# EasyEDA Pro project ProDoc_PSM_2025-09-14.epro, board PSM_PSB
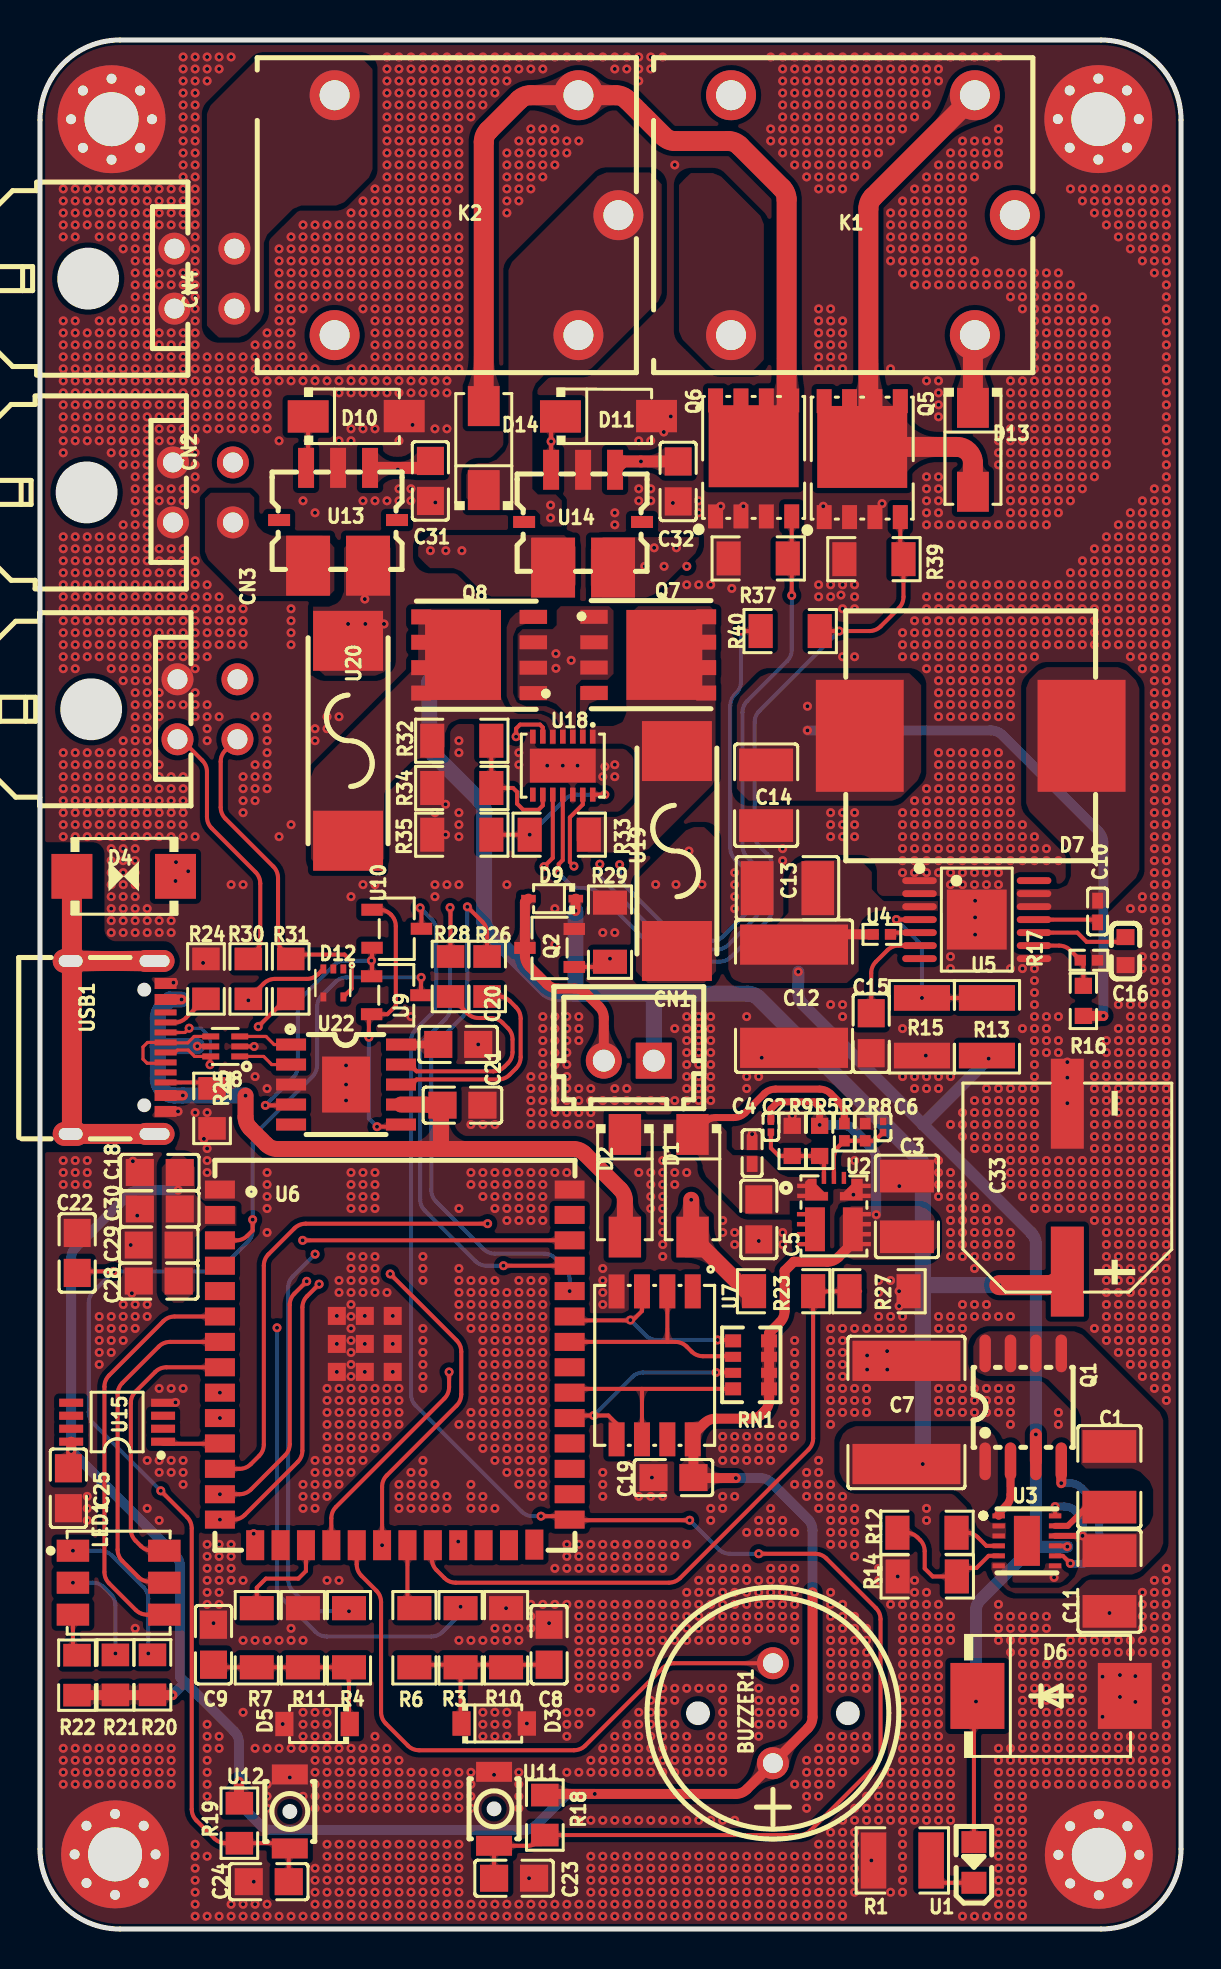
[diagram p1: board, top side]
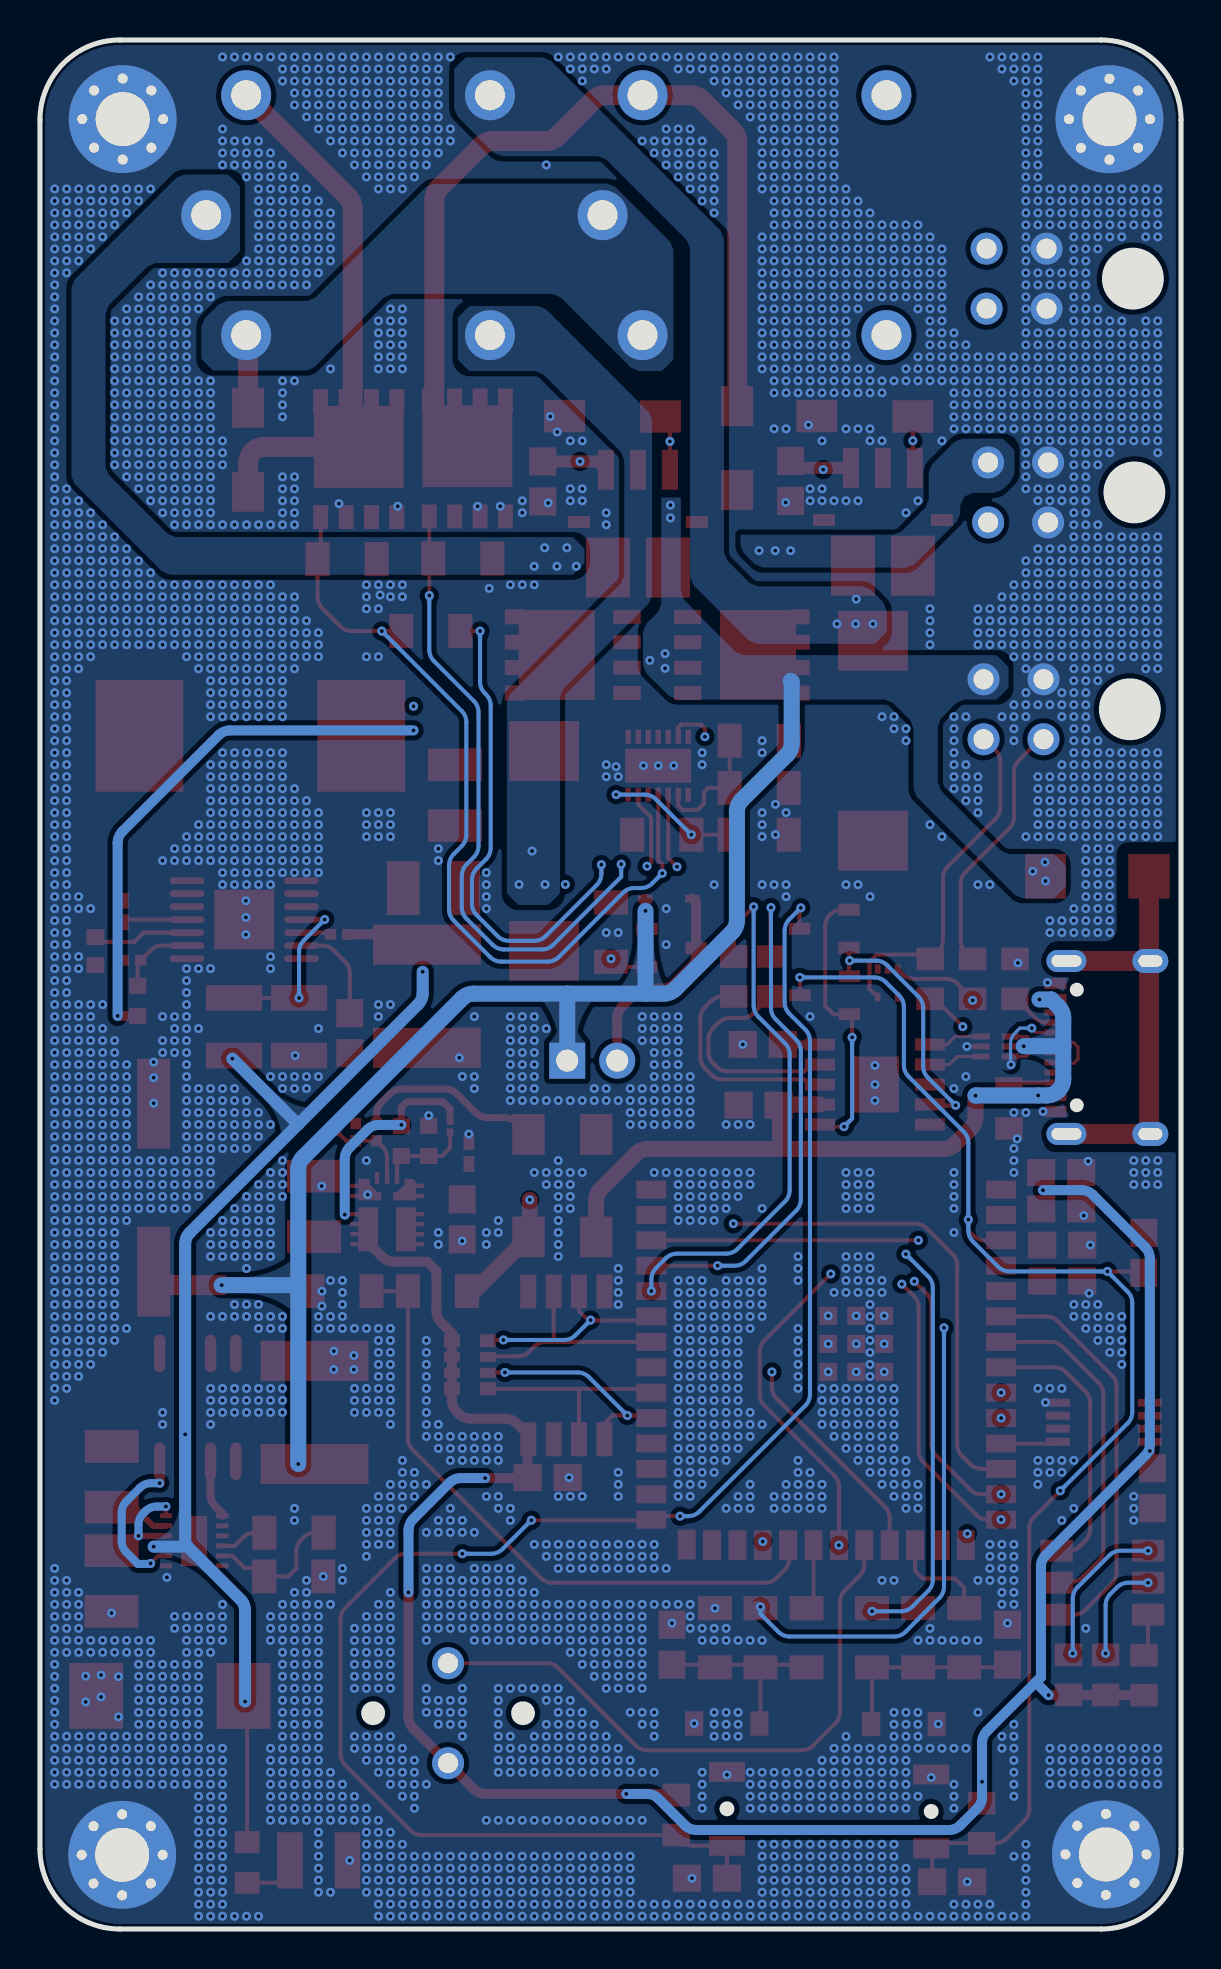
[diagram p2: board, bottom side, seen from below]

Outline 57.1 x 94.49 mm; copper layers: Top Layer, Inner1, Inner2, Bottom Layer. Coordinates in mm from the lower left corner of the outline.
Outline path: 0,90.49 0,4 arc(1.17,1.17) 4,0 53.1,0 arc(55.93,1.17) 57.1,4 57.1,90.49 arc(55.93,93.32) 53.1,94.49 4,94.49 arc(1.17,93.32) 0,90.49
Stack: Top Layer 0.035mm Outer layer thickness 1oz / Dielectric1 0.2104mm 7628 RC49% 8.6mil / Inner1 0.0152mm Inner layer thickness / Dielectric2 1.065mm 1.1mm H/HOZ Copper / Inner2 0.0152mm Inner layer thickness / Dielectric3 0.2104mm 7628 RC49% 8.6mil / Bottom Layer 0.035mm Outer layer thickness 1oz

## Design rules (mm)
net DN: DP2
net DP: DP2
net DPP: DP1
net DNN: DP1
template: Custom Config
spacing copperThickness1oz (default): track to track 0.152, other pairs 0.152 to 0.3
spacing copperThickness2oz: track to track 0.203, other pairs 0.152 to 0.3
track width copperThickness1oz (default): min 0.203, default 0.203, max 2.54
track width copperThickness2oz: min 0.203, default 0.203, max 2.54
differential pair differentialPair (default): width min 0.157, default 0.157, max 0.157; gap min 0.203, default 0.203
via viaSize (default): diameter min 0.4, default 0.45, max 10; hole min 0.2, default 0.2, max 6.3

## Placement (name value [footprint] x y rotation side)
BUZZER1  4kHz  [BUZ-TH_PKM13EPYH4002-B0]  36.68 10.8 90 top
C1  100nF  [C1210]  53.51 22.62 270 top
C2  22pF  [C0201]  36.58 40.13 90 top
C3  47uF  [C1210]  43.38 36.14 270 top
C4  100nF  [C0402]  35.64 38.81 270 top
C5  10uF  [C0805]  35.97 35.49 90 top
C6  10nF  [C0201]  42.19 40.12 270 top
C7  1uF  [C2220]  43.36 25.84 90 top
C8  100nF  [C0805]  25.48 14.22 270 top
C9  100nF  [C0805]  8.68 14.22 270 top
C10  10nF  [C0402]  52.92 50.9 270 top
C11  100nF  [C1210]  53.52 17.41 90 top
C12  1uF  [C2220]  37.73 46.66 90 top
C13  100nF  [C1210]  37.4 52.06 0 top
C14  100uF  [C1210]  36.34 56.71 90 top
C15  22nF  [C0805]  41.59 44.81 90 top
C16  1uF  [C0603]  54.32 48.91 90 top
C18  100nF  [C0805]  6 37.84 0 top
C19  100nF  [C0805]  31.7 22.58 0 top
C20  100nF  [C0805]  20.93 44.25 0 top
C21  100nF  [C0805]  21.14 41.21 0 top
C22  2.2uF  [C0805]  1.86 33.82 270 top
C23  100nF  [C0805]  23.72 2.54 0 top
C24  100nF  [C0805]  11.45 2.37 180 top
C25  100nF  [C0805]  1.42 22.05 90 top
C28  100nF  [C0805]  5.94 32.41 0 top
C29  100nF  [C0805]  5.94 34.21 0 top
C30  100nF  [C0805]  5.99 36.02 0 top
C31  100nF  [C0805]  19.54 72.43 90 top
C32  100nF  [C0805]  31.93 72.41 90 top
C33  1200uF  [CAP-SMD_BD10.0-L10.3-W10.3-FD-LS11.0]  51.41 37.08 90 top
CN1  ZX-XH2.54-2PZZ  [CONN-TH_2P-P2.50_HX25003-2A]  29.46 43.43 180 top
CN2  430450400  [CONN-TH_0430450400]  8.15 71.86 270 top
CN3  430450400  [CONN-TH_0430450400]  8.38 61.01 270 top
CN4  430450400  [CONN-TH_0430450400]  8.23 82.55 270 top
D1  US1M  [SMA_L4.4-W2.8-LS5.4-RD]  32.65 37.18 270 top
D2  US1M  [SMA_L4.4-W2.8-LS5.4-RD]  29.27 37.18 270 top
D3  MMSZ5232B  [SOD-123_L2.7-W1.6-LS3.7-RD]  22.73 10.28 0 top
D4  SMBJ58CA  [SMB_L4.6-W3.6-LS5.3-BI]  4.19 52.65 0 top
D5  MMSZ5232B  [SOD-123_L2.7-W1.6-LS3.7-RD]  13.87 10.25 180 top
D6  SMCJ58A  [SMC_L6.9-W5.8-LS7.9-RD]  50.6 11.66 0 top
D7  68uH  [IND-SMD_L12.5-W12.5-SRR1280-150M]  46.57 59.68 180 top
D8  USBLC6-2P6  [SOT-666-6_L1.6-W1.2-P0.50-LS1.6-BR]  9.27 44.15 0 top
D9  BAT46WJ,115  [SOD-323F_L2.0-W1.6-LS2.5-RD]  25.63 51.54 180 top
D10  1SMA4728A  [SMA_L4.3-W2.6-LS5.0-RD]  15.82 75.67 0 top
D11  1SMA4728A  [SMA_L4.3-W2.6-LS5.0-RD]  28.45 75.67 0 top
D12  TPD2E2U06DRLR  [SOT-553-5_L1.6-W1.2-P0.50-LS1.6-TL-1]  14.68 47.32 270 top
D13  1N4007  [SMA_L4.3-W2.5-LS5.0-RD]  46.69 73.99 270 top
D14  1N4007  [SMA_L4.3-W2.5-LS5.0-RD]  22.21 74.07 90 top
J1  SCREW-MOUNTING-HOLE-3MM  [MountingHole:MountingHole_2.7mm_M2.5_Pad_Via]  3.76 3.73 90 top
J2  SCREW-MOUNTING-HOLE-3MM  [MountingHole:MountingHole_2.7mm_M2.5_Pad_Via]  3.58 90.53 180 top
J3  SCREW-MOUNTING-HOLE-3MM  [MountingHole:MountingHole_2.7mm_M2.5_Pad_Via]  52.98 3.71 0 top
J4  SCREW-MOUNTING-HOLE-3MM  [MountingHole:MountingHole_2.7mm_M2.5_Pad_Via]  52.96 90.53 0 top
K1  SRD-48VDC-SL-C  [RELAY-TH_SRD-48VDC-SL-C]  41.68 85.73 180 top
K2  SRD-48VDC-SL-C  [RELAY-TH_SRD-48VDC-SL-C]  21.84 85.73 180 top
LED1  HL-AF-5060H271BU46FU79GC-S1-THL  [LED-ARRAY-SMD_6P-L5.4-W5.0-TL-FD]  3.94 17.32 0 top
Q1  FDS3992  [SO-8_L4.9-W3.9-P1.27-LS5.9-BL]  49.2 26.09 0 top
Q2  AO3400A  [SOT-23-3_L2.9-W1.6-P1.90-LS2.8-BR]  25.5 49.07 0 top
Q5  SI7456  [POWERPAK-SO-8_L5.9-W4.9-P1.27-LS6.2-BL]  41.15 73.52 0 top
Q6  SI7456  [POWERPAK-SO-8_L5.9-W4.9-P1.27-LS6.2-BL]  35.71 73.56 0 top
Q7  CSD19532Q5B  [SON-8_L5.0-W6.0-P1.27-BL-1]  30.53 63.73 270 top
Q8  CSD19532Q5B  [SON-8_L5.0-W6.0-P1.27-BL-1]  21.88 63.73 90 top
R1  22kΩ  [R1210]  43.15 3.43 0 top
R2  22.1kΩ  [R0402]  40.25 39.86 90 top
R3  180kΩ  [R1206]  21.05 14.57 270 top
R4  180kΩ  [R1206]  15.46 14.57 270 top
R5  135kΩ  [R0603]  39.01 39.42 90 top
R6  100Ω  [R1206]  18.74 14.57 90 top
R7  100Ω  [R1206]  10.85 14.57 90 top
R8  10kΩ  [R0402]  41.3 39.86 270 top
R9  30kΩ  [R0603]  37.64 39.42 270 top
R10  10kΩ  [R1206]  23.32 14.57 90 top
R11  10kΩ  [R1206]  13.16 14.57 90 top
R12  105kΩ  [R1206]  44.39 19.82 0 top
R13  75kΩ  [R1210]  47.39 45.13 270 top
R14  2.21kΩ  [R1206]  44.4 17.63 0 top
R15  2.8kΩ  [R1210]  44.13 45.13 90 top
R16  3kΩ  [R0603]  52.21 46.43 270 top
R17  2kΩ  [R0402]  52.49 48.46 180 top
R18  10kΩ  [R0805]  25.26 5.7 270 top
R19  10kΩ  [R0805]  9.98 5.29 270 top
R20  300Ω  [R0805]  1.85 12.7 270 top
R21  300Ω  [R0805]  3.78 12.71 270 top
R22  300Ω  [R0805]  5.63 12.71 270 top
R23  33kΩ  [R1206]  37.21 31.9 180 top
R24  5.1kΩ  [R0805]  8.31 47.52 270 top
R25  5.1kΩ  [R0805]  8.61 41.05 90 top
R26  0Ω  [R0805]  22.37 47.65 90 top
R27  33kΩ  [R1206]  41.99 31.9 180 top
R28  0Ω  [R0805]  20.55 47.65 90 top
R29  68kΩ  [R1206]  28.52 49.86 90 top
R30  33Ω  [R0805]  10.43 47.52 90 top
R31  33Ω  [R0805]  12.55 47.52 90 top
R32  340kΩ  [R1206]  21.11 59.44 180 top
R33  340kΩ  [R1206]  25.98 54.74 0 top
R34  12.7kΩ  [R1206]  21.11 57.07 0 top
R35  12.7kΩ  [R1206]  21.11 54.74 0 top
R37  33kΩ  [R1206]  35.94 68.55 180 top
R39  10MΩ  [R1206]  41.73 68.52 0 top
R40  10kΩ  [R1206]  37.54 64.92 180 top
RN1  10kΩ  [RES-ARRAY-SMD_0603-8P-L3.2-W1.6-BL]  35.59 28.22 270 top
U1  APT2012LZGCK  [LED-SMD_L2.0-W1.3-R-RD]  46.73 3.33 90 top
U2  TPSM863252RDXR  [QFN-7_L4.0-W3.3_TPSM863257RDXR]  39.73 36.28 0 top
U3  LM74800QDRRRQ1  [WSON-12_L3.0-W3.0-P0.50-TL-EP-2]  49.39 19.41 0 top
U4  261kΩ  [R0402]  42.13 49.75 180 top
U5  LM5161PWPR  [HTSSOP-14_L5.0-W4.4-P0.65-LS6.4-BL-EP3.0]  46.88 50.49 270 top
U6  ESP32-S3-WROOM-1U-N8R8  [WIRELM-SMD_ESP32-S3-WROOM-1U]  17.75 28.09 0 top
U7  MKDV8GIL-AST  [LGA-8_L6.0-W8.0-P1.27-TL]  30.76 28.19 270 top
U9  BSS138  [SOT-23-3_L2.9-W1.6-P1.90-LS2.8-BR]  17.83 46.71 180 top
U10  BSS138  [SOT-23-3_L2.9-W1.6-P1.90-LS2.8-BR]  17.85 50.03 180 top
U11  TD-1183SN-1.7H-250  [KEY-SMD_L3.0-W2.5-LS4.0]  22.72 6.01 90 top
U12  TD-1183SN-1.7H-250  [KEY-SMD_L3.0-W2.5-LS4.0]  12.5 5.88 90 top
U13  ACS781LLRTR-100B-T  [PSOF-7_L6.4-W4.8-BL]  14.92 70.64 180 top
U14  ACS781LLRTR-100B-T  [PSOF-7_L6.4-W4.8-BL]  27.18 70.54 180 top
U15  DS18B20U-MS  [MSOP-8_L3.0-W3.0-P0.65-LS4.9-BL-1]  3.86 25.35 90 top
U18  LTC4355IDE#PBF  [DFN-14_L4.0-W3.0-P0.50-BL-EP]  26.16 58.19 180 top
U19  SCT1032T6.3A250V  [FUSE-SMD_L10.3-W3.3]  31.87 53.92 90 top
U20  SCT1032T6.3A250V  [FUSE-SMD_L10.3-W3.3]  15.42 59.44 270 top
U22  CH340K  [ESOP-10_L4.9-W3.9-P1.00-LS6.2-BL-EP]  15.32 42.24 270 top
USB1  TYPE-C 16PIN 2MD(073)  [USB-C-SMD_TYPE-C-6PIN-2MD-073]  3.91 44.09 270 top

## Footprints (pads in the part's own frame, mm; a bottom-side part is the same pattern mirrored in y, then rotated)
BUZ-TH_PKM13EPYH4002-B0
  round 1.6 hole 1: 1(-2.5,0) 2(2.5,0)
C0201
  rect 0.368x0.324 smd: 1(-0.275,0) 2(0.275,0)
C0402
  rect 0.79x0.54 smd: 1(-0.545,0) 2(0.545,0)
C0603
  rect 0.8x0.9 smd: 1(-0.7,0) 2(0.7,0)
C0805
  rect 1.41x1.35 smd: 1(-1,0) 2(1,0)
C1210
  rect 1.635x2.7 smd: 1(-1.518,0) 2(1.518,0)
C2220
  rect 2.01x5.4 smd: 1(-2.58,0) 2(2.58,0)
CAP-SMD_BD10.0-L10.3-W10.3-FD-LS11.0
  rect 4.5x1.65 smd: 1(-4.2,0) 2(4.2,0)
CONN-TH_2P-P2.50_HX25003-2A
  rect 1.8x1.8 hole 1.1: 1(-1.25,0)
  round 1.8 hole 1.1: 2(1.25,0)
CONN-TH_0430450400
  round 1.6 hole 1: 1(1.5,-1.5) 2(-1.5,-1.5) 3(1.5,1.5) 4(-1.5,1.5)
DFN-14_L4.0-W3.0-P0.50-BL-EP
  rect 0.28x0.7 smd: 1(-1.5,-1.45) 2(-1,-1.45) 3(-0.5,-1.45) 4(0,-1.45) 5(0.5,-1.45) 6(1,-1.45) 7(1.5,-1.45) 8(1.5,1.45) 9(1,1.45) 10(0.5,1.45) 11(0,1.45) 12(-0.5,1.45) 13(-1,1.45) 14(-1.5,1.45)
  rect 3.3x1.7 smd: 15(0,0)
ESOP-10_L4.9-W3.9-P1.00-LS6.2-BL-EP
  rect 0.6x1.5 smd: 1(-2,-2.75) 2(-1,-2.75) 3(0,-2.75) 4(1,-2.75) 5(2,-2.75) 6(2,2.75) 7(1,2.75) 8(0,2.75) 9(-1,2.75) 10(-2,2.75)
  rect 2.8x2.4 smd: 11(0,0)
FUSE-SMD_L10.3-W3.3
  rect 3x3.5 smd: 1(-5,0) 2(5,0)
HTSSOP-14_L5.0-W4.4-P0.65-LS6.4-BL-EP3.0
  oval 0.343x1.732 smd: 1(-1.95,-2.866) 2(-1.3,-2.866) 3(-0.65,-2.866) 4(0,-2.866) 5(0.65,-2.866) 6(1.3,-2.866) 7(1.95,-2.866) 8(1.95,2.866) 9(1.3,2.866) 10(0.65,2.866) 11(0,2.866) 12(-0.65,2.866) 13(-1.3,2.866) 14(-1.95,2.866)
  rect 3x3 smd: 15(0,0)
IND-SMD_L12.5-W12.5-SRR1280-150M
  rect 4.4x5.6 smd: 1(-5.55,0) 2(5.55,0)
KEY-SMD_L3.0-W2.5-LS4.0
  rect 1x1.8 smd: 1(-1.85,0) 2(1.85,0)
LED-ARRAY-SMD_6P-L5.4-W5.0-TL-FD
  rect 1.625x1.1 smd: 1(-2.288,1.6) 2(-2.288,0) 3(-2.288,-1.6) 4(2.288,-1.6) 5(2.288,0) 6(2.288,1.6)
LED-SMD_L2.0-W1.3-R-RD
  rect 1.1x1.25 smd: 1(1.016,0) 2(-1.016,0)
LGA-8_L6.0-W8.0-P1.27-TL
  rect 1.7x0.8 smd: 1(-3.7,1.905) 2(-3.7,0.635) 3(-3.7,-0.635) 4(-3.7,-1.905) 5(3.7,-1.905) 6(3.7,-0.635) 7(3.7,0.635) 8(3.7,1.905)
MountingHole:MountingHole_2.7mm_M2.5_Pad_Via
  round 0.8 hole 0.5: 1(-2.025,0) 1(-1.432,1.432) 1(-1.432,-1.432) 1(0,2.025) 1(0,-2.025) 1(1.432,1.432) 1(1.432,-1.432) 1(2.025,0)
  round 5.4 hole 2.7: 1(0,0)
MSOP-8_L3.0-W3.0-P0.65-LS4.9-BL-1
  rect 0.406x1.2 smd: 1(-0.975,-2.3) 2(-0.325,-2.3) 3(0.325,-2.3) 4(0.975,-2.3) 5(0.975,2.3) 6(0.325,2.3) 7(-0.325,2.3) 8(-0.975,2.3)
POWERPAK-SO-8_L5.9-W4.9-P1.27-LS6.2-BL
  rect 0.75x1.2 smd: 1(-1.905,-2.9) 2(-0.635,-2.9) 3(0.635,-2.9) 4(1.905,-2.9) 5(1.905,2.9) 6(0.635,2.9) 7(-0.635,2.9) 8(-1.905,2.9)
  rect 4.5x4.1 smd: 8(0,0.609)
PSOF-7_L6.4-W4.8-BL
  rect 0.8x2 smd: 1(-1.601,-2.446) 2(0,-2.446) 3(1.6,-2.446)
  rect 1.1x0.6 smd: 4(2.95,0.164) 7(-2.95,0.164)
  rect 2.2x3 smd: 5(1.5,2.446) 6(-1.5,2.446)
QFN-7_L4.0-W3.3_TPSM863257RDXR
  custom 1.54x1.08 smd: 1(-0.975,0.697) 4(0.975,0.697)
  custom 1.4x2.195 smd: 2(-1.05,-1.286) 3(1.05,-1.286)
  rect 0.22x0.6 smd: 5(0.5,1.286) 6(0,1.286) 7(-0.5,1.286)
R0402
  rect 0.566x0.54 smd: 1(-0.433,0) 2(0.433,0)
R0603
  rect 0.806x0.864 smd: 1(-0.753,0) 2(0.753,0)
R0805
  rect 1.133x1.377 smd: 1(-1,0) 2(1,0)
R1206
  rect 1.208x1.701 smd: 1(-1.479,0) 2(1.479,0)
R1210
  rect 1.282x2.808 smd: 1(-1.441,0) 2(1.441,0)
RELAY-TH_SRD-48VDC-SL-C
  round 2.5 hole 1.5: 1(-5.1,-6) 2(-7.1,0) 3(7.1,-6) 4(7.1,6) 5(-5.1,6)
RES-ARRAY-SMD_0603-8P-L3.2-W1.6-BL
  rect 0.65x0.8 smd: 1(-1.2,-0.9) 4(1.2,-0.9) 5(1.2,0.9) 8(-1.2,0.9)
  rect 0.5x0.8 smd: 2(-0.4,-0.9) 3(0.4,-0.9) 6(0.4,0.9) 7(-0.4,0.9)
SMA_L4.3-W2.5-LS5.0-RD
  rect 2x1.593 smd: 1(-2.1,0) 2(2.1,0)
SMA_L4.3-W2.6-LS5.0-RD
  rect 2.046x1.62 smd: 1(-2.404,-0.009) 2(2.404,0.009)
SMA_L4.4-W2.8-LS5.4-RD
  rect 2.046x1.62 smd: 1(-2.566,0) 2(2.566,0)
SMB_L4.6-W3.6-LS5.3-BI
  rect 2.047x2.241 smd: 1(-2.591,0) 2(2.591,0)
SMC_L6.9-W5.8-LS7.9-RD
  rect 2.7x3.3 smd: 1(-3.687,0) 2(3.687,0)
SO-8_L4.9-W3.9-P1.27-LS5.9-BL
  oval 0.574x1.888 smd: 1(-1.905,-2.699) 2(-0.635,-2.699) 3(0.635,-2.699) 4(1.905,-2.699) 5(1.905,2.699) 6(0.635,2.699) 7(-0.635,2.699) 8(-1.905,2.699)
SOD-123_L2.7-W1.6-LS3.7-RD
  rect 0.91x1.22 smd: 1(-1.635,0) 2(1.635,0)
SOD-323F_L2.0-W1.6-LS2.5-RD
  rect 0.73x0.385 smd: 1(-1.185,0) 2(1.185,0)
SON-8_L5.0-W6.0-P1.27-BL-1
  rect 0.7x1.372 smd: 1(-1.905,-2.805) 2(-0.635,-2.805) 3(0.635,-2.805) 4(1.905,-2.805)
  rect 0.75x1 smd: 5(1.905,2.805) 6(0.635,2.805) 7(-0.635,2.805) 8(-1.905,2.805)
  rect 4.5x3.8 smd: 9(0,0.713)
SOT-23-3_L2.9-W1.6-P1.90-LS2.8-BR
  rect 1.07x0.6 smd: 1(1.235,-0.95) 2(1.235,0.95) 3(-1.235,0)
SOT-553-5_L1.6-W1.2-P0.50-LS1.6-TL-1
  rect 0.45x0.29 smd: 1(-0.7,0.5) 2(-0.7,0) 3(-0.7,-0.5) 4(0.7,-0.5) 5(0.7,0.5)
SOT-666-6_L1.6-W1.2-P0.50-LS1.6-BR
  rect 0.85x0.3 smd: 1(0.725,-0.5) 2(0.725,0) 3(0.725,0.5) 4(-0.725,0.5) 5(-0.725,0) 6(-0.725,-0.5)
USB-C-SMD_TYPE-C-6PIN-2MD-073
  rect 0.55x1.1 smd: 1(-3.2,2.375) 2(-2.4,2.375) 11(2.4,2.375) 12(3.2,2.375)
  rect 0.3x1.1 smd: 3(-1.75,2.375) 4(-1.25,2.375) 5(-0.75,2.375) 6(-0.25,2.375) 7(0.25,2.375) 8(0.75,2.375) 9(1.25,2.375) 10(1.75,2.375)
  oval 1.1x2 hole 0.6x1.5: 13(-4.325,1.825) 14(4.325,1.825)
  oval 1.2x1.8 hole 0.6x1.2: 13(-4.325,-2.375) 14(4.325,-2.375)
WIRELM-SMD_ESP32-S3-WROOM-1U
  rect 1.5x0.9 smd: 1(-8.75,8.895) 2(-8.75,7.625) 3(-8.75,6.355) 4(-8.75,5.085) 5(-8.75,3.815) 6(-8.75,2.545) 7(-8.75,1.275) 8(-8.75,0.005) 9(-8.75,-1.265) 10(-8.75,-2.535) 11(-8.75,-3.805) 12(-8.75,-5.075) 13(-8.75,-6.345) 14(-8.75,-7.615) 27(8.75,-7.615) 28(8.75,-6.345) 29(8.75,-5.075) 30(8.75,-3.805) 31(8.75,-2.535) 32(8.75,-1.265) 33(8.75,0.005) 34(8.75,1.275) 35(8.75,2.545) 36(8.75,3.815) 37(8.75,5.085) 38(8.75,6.355) 39(8.75,7.625) 40(8.75,8.895)
  rect 0.9x1.5 smd: 15(-6.985,-8.895) 16(-5.715,-8.895) 17(-4.445,-8.895) 18(-3.175,-8.895) 19(-1.905,-8.895) 20(-0.635,-8.895) 21(0.635,-8.895) 22(1.905,-8.895) 23(3.175,-8.895) 24(4.445,-8.895) 25(5.715,-8.895) 26(6.985,-8.865)
  rect 0.9x0.9 smd: 41(-2.9,2.575) 41(-2.9,1.175) 41(-2.9,-0.225) 41(-1.5,2.575) 41(-1.5,1.175) 41(-1.5,-0.225) 41(-0.1,2.575) 41(-0.1,1.175) 41(-0.1,-0.225)
WSON-12_L3.0-W3.0-P0.50-TL-EP-2
  rect 0.623x0.25 smd: 1(-1.411,1.25) 2(-1.411,0.75) 3(-1.411,0.25) 4(-1.411,-0.25) 5(-1.411,-0.75) 6(-1.411,-1.25) 7(1.411,-1.25) 8(1.411,-0.75) 9(1.411,-0.25) 10(1.411,0.25) 11(1.411,0.75) 12(1.411,1.25)
  rect 1.3x2.5 smd: 13(0,0)

## Nets
As in the schematic.

Pads without a net: D12 1 2; K2 4; U2 2 5; U3 13; U5 7 14; U6 4 5 16 24 25 26 28 29 30 33; U13 4 7; U14 4 7; U15 2 3 5 6 7; U18 8; U22 5; USB1 3 9

## Via types
v1: diameter 0.45, hole 0.2, Top Layer to Bottom Layer, 4188 vias

## Routing (per net, layer and track width the routed paths; a pad name or vN(x,y) marks a point on that pad's centre or on a via; arc(x,y) is an arc through that point)
+3V3: length 191.7
  Top Layer w0.35: C2.2 36.58,41.02 36.93,41.38 38.73,41.38 39.01,41.1 R5.2
  Top Layer w0.5: 32.7,24.46 U7.8 ; 32.7,24.46 C19.2 32.72,22.56 v1(34.82,22.56) ; 32.7,24.46 32.7,24.75 33.24,25.29 arc(33.5,25.47) 33.81,25.53 35.56,25.53 arc(35.86,25.59) 36.12,25.76 36.25,25.89 arc(36.42,26.15) 36.49,26.45 RN1.7 36.49,29.81 37.03,30.35 arc(37.2,30.61) 37.26,30.91 37.26,32.92 37.72,33.38 39.39,33.38 arc(39.7,33.44) 39.96,33.61 40.78,34.43 U2.3 ; C25.2 1.56,23.19 v1(1.56,23.91) 1.56,24.37 ; v1(38.66,16.84) 38.66,10.61 arc(38.6,10.3) 38.42,10.04 BUZZER1.1 35.37,6.99 arc(35.11,6.82) 34.81,6.76 v1(27.76,6.76) 25.32,6.76 R18.1 ; R20.2 5.61,11.7 ; 5.61,11.7 R22.2 ; 5.61,11.7 v1(6.63,11.7) ; R19.1 9.96,6.31 v1(9.96,7.37)
  Top Layer w0.6: C31.2 19.19,73.09 U13.1 ; C32.2 v1(30.07,73.41) 29.19,73.41 U14.1
  Inner2 w0.8: v1(17.91,73) 18.31,73.41 v1(30.07,73.41) 38.48,73.41 arc(38.79,73.35) 39.05,73.17 41.61,70.6 arc(41.79,70.34) 41.85,70.04 v1(41.85,35.73)
  Bottom Layer w0.5: 7.27,12.34 v1(6.63,11.7) ; 7.27,12.34 9.72,9.89 arc(9.9,9.63) 9.96,9.32 v1(9.96,7.37) 9.96,6.61 arc(10.02,6.3) 10.19,6.04 11.04,5.19 arc(11.3,5.01) 11.61,4.95 24.26,4.95 arc(24.56,5.01) 24.82,5.19 26.16,6.52 arc(26.42,6.7) 26.72,6.76 v1(27.76,6.76) ; 7.27,12.34 7.01,12.6 7.01,18.13 arc(6.95,18.44) 6.78,18.7 1.8,23.68 arc(1.7,23.8) 1.62,23.94 arc(1.58,24.09) 1.56,24.24 1.56,33.54 arc(1.62,33.84) 1.8,34.1 4.41,36.72 arc(4.67,36.9) 4.98,36.96 v1(6.91,36.96) ; v1(41.85,35.73) 41.85,38.52 arc(41.79,38.82) 41.61,39.08 40.71,39.99 arc(40.45,40.16) 40.14,40.22 v1(39.01,40.22) ; v1(38.66,16.84) 38.66,19.94 arc(38.6,20.24) 38.42,20.5 36.61,22.32 arc(36.35,22.49) 36.04,22.56 v1(34.82,22.56)
+5V: length 58.8
  Top Layer w0.5: R16.2 v1(53.21,45.67)
  Top Layer w0.8: v1(32.59,36.47) 32.59,34.68 D1.2 35.37,31.9 R23.2
  Inner2 w0.7: v1(32.59,36.47) 34.16,38.04 arc(34.33,38.3) 34.39,38.61 34.39,46.51 arc(34.45,46.81) 34.63,47.07 38.17,50.62 arc(38.34,50.88) 38.41,51.18 v1(38.41,59.95)
  Bottom Layer w0.5: v1(53.21,45.67) 53.21,54.33 arc(53.15,54.64) 52.98,54.9 48.16,59.72 arc(47.9,59.89) 47.59,59.95 v1(38.41,59.95)
  vias: v1(38.41,61.16)
+48V: length 62.4
  Top Layer w0.203: D6.1 46.73,11.48 U1.1 ; U3.9 51.37,19.16 v1(51.41,19.13)
  Top Layer w0.5: U4.2 38.58,49.75 arc(38.27,49.69) 38.01,49.52 37.73,49.24
  Top Layer w0.6: 49.84,24.74 Q1.3
  Bottom Layer w0.6: 49.71,19.13 47.07,16.49 arc(46.9,16.23) 46.84,15.92 v1(46.84,11.38) ; 49.71,19.13 v1(51.41,19.13) ; 49.71,19.13 49.84,19.25 v1(49.84,24.74) 49.84,34.26 arc(49.77,34.57) 49.6,34.83 44.18,40.25 ; v1(37.95,47.88) 37.95,46.81 arc(38.01,46.51) 38.18,46.25 44.18,40.25 ; 44.18,40.25 v1(47.47,43.54)
GND: length 0.7
  Top Layer w0.203: D8.2 v1(10.72,44.15)
  vias: v1(1.16,87.04) v1(1.16,86.44) v1(1.16,85.84) v1(1.16,85.24) v1(1.16,84.64) v1(1.16,80.44) v1(1.16,79.84) v1(1.16,79.24) v1(1.16,78.64) v1(1.16,78.04) v1(1.16,77.44) v1(1.16,76.84) v1(1.16,76.24) v1(1.16,75.64) v1(1.16,75.04) v1(1.16,74.44) v1(1.16,73.84) v1(1.16,69.64) v1(1.16,69.04) v1(1.16,68.44) v1(1.16,67.84) v1(1.16,67.24) v1(1.16,66.64) v1(1.16,66.04) v1(1.16,65.44) v1(1.16,64.84) v1(1.16,64.24) v1(1.16,63.64) v1(1.16,63.04) v1(1.16,58.84) v1(1.16,58.24) v1(1.16,57.64) v1(1.16,57.04) v1(1.16,56.44) v1(1.16,55.84) v1(1.16,55.24) v1(1.16,54.64) v1(1.16,38.44) v1(1.16,37.84) v1(1.16,37.24) v1(1.16,9.04) v1(1.16,8.44) v1(1.16,7.84) v1(1.16,7.24) v1(1.76,87.04) v1(1.76,86.44) v1(1.76,85.84) v1(1.76,85.24) v1(1.76,84.64) v1(1.76,80.44) v1(1.76,79.84) v1(1.76,79.24) v1(1.76,78.64) v1(1.76,78.04) v1(1.76,77.44) v1(1.76,76.84) v1(1.76,76.24) v1(1.76,75.64) v1(1.76,75.04) v1(1.76,74.44) v1(1.76,69.64) v1(1.76,69.04) v1(1.76,68.44) v1(1.76,67.84) v1(1.76,67.24) v1(1.76,66.64) v1(1.76,66.04) v1(1.76,65.44) v1(1.76,64.84) v1(1.76,64.24) v1(1.76,63.64) v1(1.76,63.04) v1(1.76,58.84) v1(1.76,58.24) v1(1.76,57.64) v1(1.76,57.04) v1(1.76,56.44) v1(1.76,55.84) v1(1.76,55.24) v1(1.76,54.64) v1(1.76,38.44) v1(1.76,37.84) v1(1.76,37.24) v1(1.76,9.04) v1(1.76,8.44) v1(1.76,7.84) v1(1.76,7.24) v1(2.36,87.04) v1(2.36,86.44) v1(2.36,85.84) v1(2.36,85.24) v1(2.36,79.84) v1(2.36,79.24) v1(2.36,78.64) v1(2.36,78.04) v1(2.36,77.44) v1(2.36,76.84) v1(2.36,76.24) v1(2.36,75.64) v1(2.36,75.04) v1(2.36,74.44) v1(2.36,69.64) v1(2.36,69.04) v1(2.36,68.44) v1(2.36,67.84) v1(2.36,67.24) v1(2.36,66.64) v1(2.36,66.04) v1(2.36,65.44) v1(2.36,64.84) v1(2.36,64.24) v1(2.36,63.64) v1(2.36,58.84) v1(2.36,58.24) v1(2.36,57.64) v1(2.36,57.04) v1(2.36,56.44) v1(2.36,55.84) v1(2.36,55.24) v1(2.36,54.64) v1(2.36,38.44) v1(2.36,37.84) v1(2.36,37.24) v1(2.36,21.64) v1(2.36,21.04) v1(2.36,20.44) v1(2.36,9.04) v1(2.36,8.44) v1(2.36,7.84) v1(2.36,7.24) v1(2.96,87.04) v1(2.96,86.44) v1(2.96,85.84) v1(2.96,85.24) v1(2.96,84.64) v1(2.96,80.44) v1(2.96,79.84) v1(2.96,79.24) v1(2.96,78.64) v1(2.96,78.04) v1(2.96,77.44) v1(2.96,76.84) v1(2.96,76.24) v1(2.96,75.64) v1(2.96,75.04) v1(2.96,74.44) v1(2.96,69.64) v1(2.96,69.04) v1(2.96,68.44) v1(2.96,67.84) v1(2.96,67.24) v1(2.96,66.64) v1(2.96,66.04) v1(2.96,65.44) v1(2.96,64.84) v1(2.96,64.24) v1(2.96,63.64) v1(2.96,58.84) v1(2.96,58.24) v1(2.96,57.64) v1(2.96,57.04) v1(2.96,56.44) v1(2.96,55.84) v1(2.96,55.24) v1(2.96,54.64) v1(2.96,30.64) v1(2.96,30.04) v1(2.96,29.44) v1(2.96,28.84) v1(2.96,28.24) v1(2.96,9.04) v1(2.96,8.44) v1(2.96,7.84) v1(2.96,7.24) v1(3.56,87.04) v1(3.56,86.44) v1(3.56,85.84) v1(3.56,85.24) v1(3.56,84.64) v1(3.56,80.44) v1(3.56,79.84) v1(3.56,79.24) v1(3.56,78.64) v1(3.56,78.04) v1(3.56,77.44) v1(3.56,76.84) v1(3.56,76.24) v1(3.56,75.64) v1(3.56,75.04) v1(3.56,74.44) v1(3.56,73.84) v1(3.56,69.64) v1(3.56,69.04) v1(3.56,68.44) v1(3.56,67.84) v1(3.56,67.24) v1(3.56,66.64) v1(3.56,66.04) v1(3.56,65.44) v1(3.56,64.84) v1(3.56,64.24) v1(3.56,63.64) v1(3.56,63.04) v1(3.56,58.84) v1(3.56,58.24) v1(3.56,57.64) v1(3.56,57.04) v1(3.56,56.44) v1(3.56,55.84) v1(3.56,55.24) v1(3.56,54.64) v1(3.56,54.04) v1(3.56,53.44) v1(3.56,52.84) v1(3.56,52.24) v1(3.56,51.64) v1(3.56,51.04) v1(3.56,50.44) v1(3.56,49.84) v1(3.56,30.64) v1(3.56,30.04) v1(3.56,29.44) v1(3.56,28.84) v1(3.56,9.04) v1(3.56,8.44) v1(3.56,7.84) v1(3.56,7.24) v1(4.16,87.04) v1(4.16,86.44) v1(4.16,85.84) v1(4.16,85.24) v1(4.16,84.64) v1(4.16,84.04) v1(4.16,81.04) v1(4.16,80.44) v1(4.16,79.84) v1(4.16,79.24) v1(4.16,78.64) v1(4.16,78.04) v1(4.16,77.44) v1(4.16,76.84) v1(4.16,76.24) v1(4.16,75.64) v1(4.16,75.04) v1(4.16,74.44) v1(4.16,73.84) v1(4.16,73.24) v1(4.16,70.24) v1(4.16,69.64) v1(4.16,69.04) v1(4.16,68.44) v1(4.16,67.84) v1(4.16,67.24) v1(4.16,66.64) v1(4.16,66.04) v1(4.16,65.44) v1(4.16,64.84) v1(4.16,64.24) v1(4.16,63.64) v1(4.16,63.04) v1(4.16,62.44) v1(4.16,59.44) v1(4.16,58.84) v1(4.16,58.24) v1(4.16,57.64) v1(4.16,57.04) v1(4.16,56.44) v1(4.16,55.84) v1(4.16,55.24) v1(4.16,54.64) v1(4.16,54.04) v1(4.16,53.44) v1(4.16,52.84) v1(4.16,52.24) v1(4.16,51.64) v1(4.16,51.04) v1(4.16,50.44) v1(4.16,49.84) v1(4.16,31.24) v1(4.16,30.64) v1(4.16,30.04) v1(4.16,29.44) v1(4.16,9.04) v1(4.16,8.44) v1(4.16,7.84) v1(4.16,7.24) v1(4.54,34.21) v1(4.6,31.8) v1(4.65,38.4) v1(4.76,87.04) v1(4.76,86.44) v1(4.76,85.84) v1(4.76,85.24) v1(4.76,84.64) v1(4.76,84.04) v1(4.76,83.44) v1(4.76,82.84) v1(4.76,82.24) v1(4.76,81.64) v1(4.76,81.04) v1(4.76,80.44) v1(4.76,79.84) v1(4.76,79.24) v1(4.76,78.64) v1(4.76,78.04) v1(4.76,77.44) v1(4.76,76.84) v1(4.76,76.24) v1(4.76,75.64) v1(4.76,75.04) v1(4.76,74.44) v1(4.76,73.84) v1(4.76,73.24) v1(4.76,72.64) v1(4.76,72.04) v1(4.76,71.44) v1(4.76,70.84) v1(4.76,70.24) v1(4.76,69.64) v1(4.76,69.04) v1(4.76,68.44) v1(4.76,67.84) v1(4.76,67.24) v1(4.76,66.64) v1(4.76,66.04) v1(4.76,65.44) v1(4.76,64.84) v1(4.76,64.24) v1(4.76,63.64) v1(4.76,63.04) v1(4.76,62.44) v1(4.76,61.84) v1(4.76,61.24) v1(4.76,60.64) v1(4.76,60.04) v1(4.76,59.44) v1(4.76,58.84) v1(4.76,58.24) v1(4.76,57.64) v1(4.76,57.04) v1(4.76,56.44) v1(4.76,55.84) v1(4.76,55.24) v1(4.76,54.64) v1(4.76,54.04) v1(4.76,53.44) v1(4.76,52.84) v1(4.76,52.24) v1(4.76,51.64) v1(4.76,51.04) v1(4.76,50.44) v1(4.76,49.84) v1(4.76,31.24) v1(4.76,30.64) v1(4.76,30.04) v1(4.76,15.04) v1(4.76,9.04) v1(4.76,8.44) v1(4.76,7.84) v1(4.76,7.24) v1(4.87,35.68) v1(5.36,87.04) v1(5.36,86.44) v1(5.36,85.84) v1(5.36,85.24) v1(5.36,84.64) v1(5.36,84.04) v1(5.36,83.44) v1(5.36,82.84) v1(5.36,82.24) v1(5.36,81.64) v1(5.36,81.04) v1(5.36,80.44) v1(5.36,79.84) v1(5.36,79.24) v1(5.36,78.64) v1(5.36,78.04) v1(5.36,77.44) v1(5.36,76.84) v1(5.36,76.24) v1(5.36,75.64) v1(5.36,75.04) v1(5.36,74.44) v1(5.36,73.84) v1(5.36,73.24) v1(5.36,72.64) v1(5.36,72.04) v1(5.36,71.44) v1(5.36,70.84) v1(5.36,70.24) v1(5.36,69.64) v1(5.36,69.04) v1(5.36,68.44) v1(5.36,67.84) v1(5.36,67.24) v1(5.36,66.64) v1(5.36,66.04) v1(5.36,65.44) v1(5.36,64.84) v1(5.36,64.24) v1(5.36,63.64) v1(5.36,63.04) v1(5.36,62.44) v1(5.36,61.84) v1(5.36,61.24) v1(5.36,60.64) v1(5.36,60.04) v1(5.36,59.44) v1(5.36,58.84) v1(5.36,58.24) v1(5.36,57.64) v1(5.36,57.04) v1(5.36,56.44) v1(5.36,55.84) v1(5.36,55.24) v1(5.36,54.64) v1(5.36,51.04) v1(5.36,50.44) v1(5.36,49.84) v1(5.36,31.24) v1(5.36,30.64) v1(5.36,23.44) v1(5.36,21.04) v1(5.36,9.04) v1(5.36,8.44) v1(5.36,7.84) v1(5.36,7.24) v1(5.96,87.04) v1(5.96,86.44) v1(5.96,85.84) v1(5.96,85.24) v1(5.96,82.84) v1(5.96,82.24) v1(5.96,79.84) v1(5.96,79.24) v1(5.96,78.64) v1(5.96,78.04) v1(5.96,77.44) v1(5.96,76.84) v1(5.96,76.24) v1(5.96,75.64) v1(5.96,75.04) v1(5.96,74.44) v1(5.96,72.04) v1(5.96,71.44) v1(5.96,69.04) v1(5.96,68.44) v1(5.96,67.84) v1(5.96,67.24) v1(5.96,66.64) v1(5.96,66.04) v1(5.96,65.44) v1(5.96,64.84) v1(5.96,64.24) v1(5.96,63.64) v1(5.96,61.84) v1(5.96,61.24) v1(5.96,60.64) v1(5.96,58.24) v1(5.96,57.64) v1(5.96,57.04) v1(5.96,56.44) v1(5.96,55.84) v1(5.96,55.24) v1(5.96,54.64) v1(5.96,50.44) v1(5.96,49.84) v1(5.96,27.04) v1(5.96,23.44) v1(5.96,22.84) v1(5.96,20.44) v1(5.96,9.04) v1(5.96,8.44) v1(5.96,7.84) v1(5.96,7.24) v1(6.56,87.04) v1(6.56,86.44) v1(6.56,85.84) v1(6.56,85.24) v1(6.56,82.84) v1(6.56,82.24) v1(6.56,79.84) v1(6.56,79.24) v1(6.56,78.64) v1(6.56,78.04) v1(6.56,77.44) v1(6.56,76.84) v1(6.56,76.24) v1(6.56,75.64) v1(6.56,75.04) v1(6.56,74.44) v1(6.56,72.04) v1(6.56,71.44) v1(6.56,69.04) v1(6.56,68.44) v1(6.56,67.84) v1(6.56,67.24) v1(6.56,66.64) v1(6.56,66.04) v1(6.56,65.44) v1(6.56,64.84) v1(6.56,64.24) v1(6.56,63.64) v1(6.56,61.24) v1(6.56,57.64) v1(6.56,57.04) v1(6.56,56.44) v1(6.56,55.84) v1(6.56,55.24) v1(6.56,54.64) v1(6.56,50.44) v1(6.56,49.84) v1(6.56,27.04) v1(6.56,23.44) v1(6.56,22.84) v1(6.56,9.04) v1(6.56,8.44) v1(6.56,7.84) v1(6.56,7.24) v1(6.68,47.34) v1(6.78,26.34) v1(6.91,40.89) v1(7.16,93.64) v1(7.16,93.04) v1(7.16,92.44) v1(7.16,91.84) v1(7.16,91.24) v1(7.16,90.64) v1(7.16,90.04) v1(7.16,89.44) v1(7.16,88.84) v1(7.16,88.24) v1(7.16,87.64) v1(7.16,87.04) v1(7.16,86.44) v1(7.16,85.84) v1(7.16,85.24) v1(7.16,82.84) v1(7.16,82.24) v1(7.16,79.84) v1(7.16,79.24) v1(7.16,78.64) v1(7.16,78.04) v1(7.16,77.44) v1(7.16,76.84) v1(7.16,76.24) v1(7.16,75.64) v1(7.16,75.04) v1(7.16,74.44) v1(7.16,72.04) v1(7.16,71.44) v1(7.16,69.04) v1(7.16,68.44) v1(7.16,67.84) v1(7.16,67.24) v1(7.16,66.64) v1(7.16,66.04) v1(7.16,65.44) v1(7.16,64.84) v1(7.16,64.24) v1(7.16,63.64) v1(7.16,61.24) v1(7.16,57.64) v1(7.16,57.04) v1(7.16,56.44) v1(7.16,55.84) v1(7.16,55.24) v1(7.16,54.64) v1(7.16,27.04) v1(7.16,23.44) v1(7.16,22.84) v1(7.16,22.24) v1(7.76,93.64) v1(7.76,93.04) v1(7.76,92.44) v1(7.76,91.84) v1(7.76,91.24) v1(7.76,90.64) v1(7.76,90.04) v1(7.76,89.44) v1(7.76,88.84) v1(7.76,88.24) v1(7.76,87.64) v1(7.76,87.04) v1(7.76,86.44) v1(7.76,85.84) v1(7.76,85.24) v1(7.76,84.64) v1(7.76,84.04) v1(7.76,83.44) v1(7.76,82.84) v1(7.76,82.24) v1(7.76,81.64) v1(7.76,81.04) v1(7.76,80.44) v1(7.76,79.84) v1(7.76,79.24) v1(7.76,78.64) v1(7.76,78.04) v1(7.76,77.44) v1(7.76,76.84) v1(7.76,76.24) v1(7.76,75.64) v1(7.76,75.04) v1(7.76,74.44) v1(7.76,73.84) v1(7.76,73.24) v1(7.76,72.64) v1(7.76,72.04) v1(7.76,68.44) v1(7.76,67.84) v1(7.76,67.24) v1(7.76,66.64) v1(7.76,66.04) v1(7.76,65.44) v1(7.76,64.84) v1(7.76,64.24) v1(7.76,63.64) v1(7.76,63.04) v1(7.76,61.84) v1(7.76,61.24) v1(7.76,60.64) v1(7.76,54.64) v1(7.76,40.84) v1(7.76,4.24) v1(7.76,3.64) v1(7.76,3.04) v1(7.76,2.44) v1(7.76,1.84) v1(7.76,1.24) v1(7.76,0.64) v1(8.16,48.32) v1(8.2,39.52) v1(8.36,93.64) v1(8.36,93.04) v1(8.36,92.44) v1(8.36,78.64) v1(8.36,78.04) v1(8.36,77.44) v1(8.36,76.84) v1(8.36,76.24) v1(8.36,75.64) v1(8.36,75.04) v1(8.36,67.24) v1(8.36,66.64) v1(8.36,66.04) v1(8.36,65.44) v1(8.36,64.84) v1(8.36,64.24) v1(8.36,63.64) v1(8.36,61.24) v1(8.36,60.64) v1(8.36,60.04) v1(8.36,59.44) v1(8.36,40.84) v1(8.36,39.04) v1(8.36,38.44) v1(8.36,37.84) v1(8.36,19.24) v1(8.36,18.64) v1(8.36,18.04) v1(8.36,17.44) v1(8.36,16.84) v1(8.36,16.24) v1(8.36,10.24) v1(8.36,9.64) v1(8.36,9.04) v1(8.36,8.44) v1(8.36,7.84) v1(8.36,7.24) v1(8.36,6.64) v1(8.36,3.64) v1(8.36,0.64) v1(8.68,15.3) v1(8.96,93.64) v1(8.96,93.04) v1(8.96,78.64) v1(8.96,78.04) v1(8.96,77.44) v1(8.96,76.84) v1(8.96,76.24) v1(8.96,75.64) v1(8.96,75.04) v1(8.96,66.64) v1(8.96,66.04) v1(8.96,65.44) v1(8.96,64.84) v1(8.96,64.24) v1(8.96,60.64) v1(8.96,19.24) v1(8.96,18.64) v1(8.96,18.04) v1(8.96,17.44) v1(8.96,16.84) v1(8.96,16.24) v1(8.96,9.64) v1(8.96,9.04) v1(8.96,0.64) v1(9.56,93.64) v1(9.56,78.64) v1(9.56,78.04) v1(9.56,77.44) v1(9.56,76.84) v1(9.56,76.24) v1(9.56,75.64) v1(9.56,75.04) v1(9.56,66.04) v1(9.56,65.44) v1(9.56,64.84) v1(9.56,64.24) v1(9.56,52.24) v1(9.56,19.24) v1(9.56,18.64) v1(9.56,18.04) v1(9.56,17.44) v1(9.56,1.24) v1(9.56,0.64) v1(10.16,78.64) v1(10.16,78.04) v1(10.16,77.44) v1(10.16,76.84) v1(10.16,76.24) v1(10.16,75.64) v1(10.16,75.04) v1(10.16,66.04) v1(10.16,65.44) v1(10.16,64.84) v1(10.16,64.24) v1(10.16,57.64) v1(10.16,57.04) v1(10.16,56.44) v1(10.16,55.84) v1(10.16,52.24) v1(10.16,17.44) v1(10.16,14.44) v1(10.16,10.84) v1(10.16,1.24) v1(10.16,0.64) v1(10.7,2.37) v1(10.76,79.24) v1(10.76,78.64) v1(10.76,78.04) v1(10.76,77.44) v1(10.76,76.84) v1(10.76,76.24) v1(10.76,75.64) v1(10.76,75.04) v1(10.76,60.64) v1(10.76,58.24) v1(10.76,57.64) v1(10.76,57.04) v1(10.76,56.44) v1(10.76,42.64) v1(10.76,14.44) v1(10.76,9.04) v1(10.76,1.24) v1(10.76,0.64) v1(11.36,79.84) v1(11.36,79.24) v1(11.36,78.64) v1(11.36,78.04) v1(11.36,77.44) v1(11.36,76.84) v1(11.36,76.24) v1(11.36,75.64) v1(11.36,75.04) v1(11.36,60.64) v1(11.36,60.04) v1(11.36,59.44) v1(11.36,58.84) v1(11.36,58.24) v1(11.36,57.64) v1(11.36,57.04) v1(11.36,42.04) v1(11.36,37.84) v1(11.36,37.24) v1(11.36,36.64) v1(11.36,36.04) v1(11.36,34.84) v1(11.36,14.44) v1(11.36,9.04) v1(11.36,7.24) v1(11.36,6.64) v1(11.36,6.04) v1(11.36,1.24) v1(11.36,0.64) v1(11.96,84.04) v1(11.96,83.44) v1(11.96,82.84) v1(11.96,82.24) v1(11.96,81.64) v1(11.96,81.04) v1(11.96,80.44) v1(11.96,79.84) v1(11.96,79.24) v1(11.96,78.64) v1(11.96,78.04) v1(11.96,77.44) v1(11.96,74.44) v1(11.96,54.64) v1(11.96,14.44) v1(11.96,9.04) v1(11.96,0.64) v1(12.15,10.25) v1(12.5,7.58) v1(12.56,84.64) v1(12.56,84.04) v1(12.56,83.44) v1(12.56,82.84) v1(12.56,82.24) v1(12.56,81.64) v1(12.56,81.04) v1(12.56,80.44) v1(12.56,79.84) v1(12.56,79.24) v1(12.56,78.64) v1(12.56,78.04) v1(12.56,77.44) v1(12.56,66.04) v1(12.56,65.44) v1(12.56,64.84) v1(12.56,64.24) v1(12.56,55.24) v1(12.56,15.04) v1(12.56,14.44) v1(12.56,9.04) v1(12.56,0.64) v1(13.16,85.24) v1(13.16,84.64) v1(13.16,84.04) v1(13.16,83.44) v1(13.16,82.84) v1(13.16,82.24) v1(13.16,81.64) v1(13.16,81.04) v1(13.16,78.64) v1(13.16,78.04) v1(13.16,77.44) v1(13.16,71.44) v1(13.16,22.24) v1(13.16,21.64) v1(13.16,21.04) v1(13.16,14.44) v1(13.16,10.84) v1(13.16,10.24) v1(13.16,9.64) v1(13.16,9.04) v1(13.16,6.64) v1(13.16,0.64) v1(13.76,85.24) v1(13.76,84.64) v1(13.76,84.04) v1(13.76,83.44) v1(13.76,82.84) v1(13.76,82.24) v1(13.76,81.64) v1(13.76,78.04) v1(13.76,77.44) v1(13.76,70.84) v1(13.76,60.04) v1(13.76,59.44) v1(13.76,23.44) v1(13.76,22.84) v1(13.76,22.24) v1(13.76,21.64) v1(13.76,21.04) v1(13.76,10.84) v1(13.76,10.24) v1(13.76,9.64) v1(13.76,9.04) v1(13.76,8.44) v1(13.76,7.84) v1(13.76,7.24) v1(13.76,6.64) v1(13.76,6.04) v1(13.76,3.04) v1(13.76,2.44) v1(13.76,1.84) v1(13.76,1.24) v1(13.76,0.64) v1(14.36,85.24) v1(14.36,84.64) v1(14.36,84.04) v1(14.36,83.44) v1(14.36,82.84) v1(14.36,82.24) v1(14.36,81.64) v1(14.36,77.44) v1(14.36,60.64) v1(14.36,60.04) v1(14.36,27.04) v1(14.36,26.44) v1(14.36,25.84) v1(14.36,25.24) v1(14.36,24.64) v1(14.36,24.04) v1(14.36,23.44) v1(14.36,22.84) v1(14.36,22.24) v1(14.36,21.64) v1(14.36,17.44) v1(14.36,10.84) v1(14.36,10.24) v1(14.36,9.64) v1(14.36,9.04) v1(14.36,8.44) v1(14.36,7.84) v1(14.36,7.24) v1(14.36,6.64) v1(14.36,6.04) v1(14.36,4.24) v1(14.36,3.64) v1(14.36,3.04) v1(14.36,2.44) v1(14.36,1.84) v1(14.36,1.24) v1(14.36,0.64) v1(14.85,30.67) v1(14.85,29.27) v1(14.85,27.87) v1(14.96,85.24) v1(14.96,84.64) v1(14.96,84.04) v1(14.96,83.44) v1(14.96,82.84) v1(14.96,82.24) v1(14.96,81.64) v1(14.96,77.44) v1(14.96,76.84) v1(14.96,74.44) v1(14.96,60.64) v1(14.96,32.44) v1(14.96,31.84) v1(14.96,27.04) v1(14.96,26.44) v1(14.96,25.84) v1(14.96,25.24) v1(14.96,24.64) v1(14.96,24.04) v1(14.96,23.44) v1(14.96,22.84) v1(14.96,22.24) v1(14.96,17.44) v1(14.96,9.04) v1(14.96,8.44) v1(14.96,7.84) v1(14.96,7.24) v1(14.96,6.64) v1(14.96,6.04) v1(14.96,4.24) v1(14.96,3.64) v1(14.96,3.04) v1(14.96,2.44) v1(14.96,1.84) v1(14.96,1.24) v1(14.96,0.64) v1(15.32,43.2) v1(15.32,42.24) v1(15.32,41.44) v1(15.56,85.84) v1(15.56,85.24) v1(15.56,84.64) v1(15.56,84.04) v1(15.56,83.44) v1(15.56,82.84) v1(15.56,82.24) v1(15.56,81.64) v1(15.56,78.04) v1(15.56,77.44) v1(15.56,76.84) v1(15.56,75.04) v1(15.56,74.44) v1(15.56,51.64) v1(15.56,37.84) v1(15.56,37.24) v1(15.56,36.64) v1(15.56,36.04) v1(15.56,33.64) v1(15.56,33.04) v1(15.56,32.44) v1(15.56,31.84) v1(15.56,31.24) v1(15.56,30.64) v1(15.56,30.04) v1(15.56,29.44) v1(15.56,28.84) v1(15.56,28.24) v1(15.56,27.64) v1(15.56,27.04) v1(15.56,26.44) v1(15.56,25.84) v1(15.56,25.24) v1(15.56,24.64) v1(15.56,24.04) v1(15.56,23.44) v1(15.56,22.84) v1(15.56,9.04) v1(15.56,8.44) v1(15.56,7.84) v1(15.56,7.24) v1(15.56,6.64) v1(15.56,6.04) v1(15.56,4.24) v1(15.56,3.64) v1(15.56,3.04) v1(15.56,2.44) v1(15.56,1.84) v1(15.56,1.24) v1(15.56,0.64) v1(16.16,86.44) v1(16.16,85.84) v1(16.16,85.24) v1(16.16,84.64) v1(16.16,84.04) v1(16.16,83.44) v1(16.16,82.84) v1(16.16,82.24) v1(16.16,81.64) v1(16.16,81.04) v1(16.16,78.04) v1(16.16,77.44) v1(16.16,76.84) v1(16.16,75.04) v1(16.16,71.44) v1(16.16,52.24) v1(16.16,37.84) v1(16.16,37.24) v1(16.16,36.64) v1(16.16,36.04) v1(16.16,33.64) v1(16.16,33.04) v1(16.16,32.44) v1(16.16,31.84) v1(16.16,27.04) v1(16.16,26.44) v1(16.16,25.84) v1(16.16,25.24) v1(16.16,24.64) v1(16.16,24.04) v1(16.16,23.44) v1(16.16,9.04) v1(16.16,8.44) v1(16.16,7.84) v1(16.16,7.24) v1(16.16,6.64) v1(16.16,6.04) v1(16.16,4.24) v1(16.16,3.64) v1(16.16,3.04) v1(16.16,2.44) v1(16.16,1.84) v1(16.16,1.24) v1(16.16,0.64) v1(16.25,30.67) v1(16.25,29.27) v1(16.25,27.87) v1(16.76,87.04) v1(16.76,86.44) v1(16.76,85.84) v1(16.76,85.24) v1(16.76,84.64) v1(16.76,84.04) v1(16.76,83.44) v1(16.76,82.84) v1(16.76,82.24) v1(16.76,81.64) v1(16.76,81.04) v1(16.76,80.44) v1(16.76,79.84) v1(16.76,79.24) v1(16.76,78.64) v1(16.76,78.04) v1(16.76,77.44) v1(16.76,76.84) v1(16.76,75.04) v1(16.76,71.44) v1(16.76,52.24) v1(16.76,37.84) v1(16.76,37.24) v1(16.76,36.64) v1(16.76,36.04) v1(16.76,33.64) v1(16.76,33.04) v1(16.76,32.44) v1(16.76,31.84) v1(16.76,27.04) v1(16.76,26.44) v1(16.76,25.84) v1(16.76,25.24) v1(16.76,24.64) v1(16.76,24.04) v1(16.76,9.64) v1(16.76,9.04) v1(16.76,8.44) v1(16.76,7.84) v1(16.76,7.24) v1(16.76,6.64) v1(16.76,6.04) v1(16.76,4.24) v1(16.76,3.64) v1(16.76,3.04) v1(16.76,2.44) v1(16.76,1.84) v1(16.76,1.24) v1(16.76,0.64) v1(17.36,93.64) v1(17.36,93.04) v1(17.36,92.44) v1(17.36,91.84) v1(17.36,91.24) v1(17.36,90.64) v1(17.36,90.04) v1(17.36,89.44) v1(17.36,88.84) v1(17.36,88.24) v1(17.36,87.64) v1(17.36,87.04) v1(17.36,86.44) v1(17.36,85.84) v1(17.36,85.24) v1(17.36,84.64) v1(17.36,84.04) v1(17.36,83.44) v1(17.36,82.84) v1(17.36,82.24) v1(17.36,81.64) v1(17.36,81.04) v1(17.36,80.44) v1(17.36,79.84) v1(17.36,79.24) v1(17.36,78.64) v1(17.36,78.04) v1(17.36,77.44) v1(17.36,76.84) v1(17.36,71.44) v1(17.36,31.84) v1(17.36,27.04) v1(17.36,26.44) v1(17.36,25.84) v1(17.36,25.24) v1(17.36,24.64) v1(17.36,9.04) v1(17.36,8.44) v1(17.36,7.84) v1(17.36,7.24) v1(17.36,6.64) v1(17.36,6.04) v1(17.36,4.24) v1(17.36,3.64) v1(17.36,3.04) v1(17.36,2.44) v1(17.36,1.84) v1(17.36,1.24) v1(17.36,0.64) v1(17.65,30.67) v1(17.65,29.27) v1(17.65,27.87) v1(17.96,93.64) v1(17.96,93.04) v1(17.96,92.44) v1(17.96,91.84) v1(17.96,91.24) v1(17.96,90.64) v1(17.96,90.04) v1(17.96,89.44) v1(17.96,88.84) v1(17.96,88.24) v1(17.96,87.64) v1(17.96,87.04) v1(17.96,86.44) v1(17.96,85.84) v1(17.96,85.24) v1(17.96,84.64) v1(17.96,84.04) v1(17.96,83.44) v1(17.96,82.84) v1(17.96,82.24) v1(17.96,81.64) v1(17.96,81.04) v1(17.96,80.44) v1(17.96,79.84) v1(17.96,79.24) v1(17.96,78.64) v1(17.96,78.04) v1(17.96,77.44) v1(17.96,76.84) v1(17.96,74.44) v1(17.96,72.04) v1(17.96,71.44) v1(17.96,27.04) v1(17.96,26.44) v1(17.96,25.84) v1(17.96,25.24) v1(17.96,22.24) v1(17.96,21.64) v1(17.96,21.04) v1(17.96,8.44) v1(17.96,7.84) v1(17.96,7.24) v1(17.96,6.64) v1(17.96,6.04) v1(17.96,4.24) v1(17.96,3.64) v1(17.96,3.04) v1(17.96,2.44) v1(17.96,1.84) v1(17.96,1.24) v1(17.96,0.64) v1(18.56,93.64) v1(18.56,93.04) v1(18.56,92.44) v1(18.56,91.84) v1(18.56,91.24) v1(18.56,90.64) v1(18.56,90.04) v1(18.56,89.44) v1(18.56,88.84) v1(18.56,88.24) v1(18.56,87.64) v1(18.56,87.04) v1(18.56,86.44) v1(18.56,85.84) v1(18.56,85.24) v1(18.56,84.64) v1(18.56,84.04) v1(18.56,83.44) v1(18.56,82.84) v1(18.56,82.24) v1(18.56,81.64) v1(18.56,81.04) v1(18.56,80.44) v1(18.56,79.84) v1(18.56,79.24) v1(18.56,78.64) v1(18.56,78.04) v1(18.56,77.44) v1(18.56,76.84) v1(18.56,72.04) v1(18.56,71.44) v1(18.56,45.64) v1(18.56,22.84) v1(18.56,22.24) v1(18.56,21.64) v1(18.56,21.04) v1(18.56,7.84) v1(18.56,7.24) v1(18.56,6.64) v1(18.56,6.04) v1(18.56,4.24) v1(18.56,3.64) v1(18.56,3.04) v1(18.56,2.44) v1(18.56,1.84) v1(18.56,1.24) v1(18.56,0.64) v1(18.64,75.23) v1(19.16,93.64) v1(19.16,93.04) v1(19.16,92.44) v1(19.16,91.84) v1(19.16,91.24) v1(19.16,90.64) v1(19.16,90.04) v1(19.16,89.44) v1(19.16,88.84) v1(19.16,88.24) v1(19.16,87.64) v1(19.16,87.04) v1(19.16,86.44) v1(19.16,85.84) v1(19.16,85.24) v1(19.16,84.64) v1(19.16,84.04) v1(19.16,83.44) v1(19.16,82.84) v1(19.16,82.24) v1(19.16,81.64) v1(19.16,81.04) v1(19.16,80.44) v1(19.16,79.84) v1(19.16,79.24) v1(19.16,78.64) v1(19.16,78.04) v1(19.16,77.44) v1(19.16,76.84) v1(19.16,33.64) v1(19.16,33.04) v1(19.16,32.44) v1(19.16,30.04) v1(19.16,29.44) v1(19.16,28.84) v1(19.16,28.24) v1(19.16,27.64) v1(19.16,27.04) v1(19.16,23.44) v1(19.16,22.84) v1(19.16,22.24) v1(19.16,21.64) v1(19.16,21.04) v1(19.16,7.84) v1(19.16,7.24) v1(19.16,6.64) v1(19.16,6.04) v1(19.16,4.24) v1(19.16,3.64) v1(19.16,3.04) v1(19.16,2.44) v1(19.16,1.84) v1(19.16,1.24) v1(19.16,0.64) v1(19.76,93.64) v1(19.76,93.04) v1(19.76,92.44) v1(19.76,91.84) v1(19.76,91.24) v1(19.76,90.64) v1(19.76,90.04) v1(19.76,89.44) v1(19.76,88.84) v1(19.76,88.24) v1(19.76,87.64) v1(19.76,87.04) v1(19.76,86.44) v1(19.76,85.84) v1(19.76,85.24) v1(19.76,84.64) v1(19.76,84.04) v1(19.76,83.44) v1(19.76,82.84) v1(19.76,82.24) v1(19.76,81.64) v1(19.76,81.04) v1(19.76,80.44) v1(19.76,79.84) v1(19.76,79.24) v1(19.76,78.64) v1(19.76,78.04) v1(19.76,77.44) v1(19.76,76.84) v1(19.76,75.04) v1(19.78,71.35) v1(19.76,55.84) v1(19.76,52.24) v1(19.76,51.64) v1(19.76,22.24) v1(19.76,21.64) v1(19.76,21.04) v1(19.76,7.84) v1(19.76,7.24) v1(19.76,6.64) v1(19.76,6.04) v1(19.76,4.24) v1(19.76,3.64) v1(19.76,3.04) v1(19.76,2.44) v1(19.76,1.84) v1(19.76,1.24) v1(19.76,0.64) v1(20.3,56.26) v1(20.3,54.74) v1(20.36,93.64) v1(20.36,93.04) v1(20.36,92.44) v1(20.36,91.84) v1(20.36,91.24) v1(20.36,90.64) v1(20.36,90.04) v1(20.36,89.44) v1(20.36,88.84) v1(20.36,88.24) v1(20.36,87.64) v1(20.36,87.04) v1(20.36,86.44) v1(20.36,85.84) v1(20.36,85.24) v1(20.36,84.64) v1(20.36,84.04) v1(20.36,83.44) v1(20.36,82.84) v1(20.36,82.24) v1(20.36,81.64) v1(20.36,81.04) v1(20.36,80.44) v1(20.36,79.84) v1(20.36,79.24) v1(20.36,78.64) v1(20.36,78.04) v1(20.36,77.44) v1(20.36,76.84) v1(20.36,75.04) v1(20.36,52.24) v1(20.36,21.64) v1(20.36,21.04) v1(20.36,7.84) v1(20.36,7.24) v1(20.36,6.64) v1(20.36,6.04) v1(20.36,4.24) v1(20.36,3.64) v1(20.36,3.04) v1(20.36,2.44) v1(20.36,1.84) v1(20.36,1.24) v1(20.36,0.64) v1(20.96,93.64) v1(20.96,93.04) v1(20.96,92.44) v1(20.96,91.84) v1(20.96,91.24) v1(20.96,90.64) v1(20.96,90.04) v1(20.96,89.44) v1(20.96,88.84) v1(20.96,88.24) v1(20.96,87.64) v1(20.96,87.04) v1(20.96,84.64) v1(20.96,84.04) v1(20.96,83.44) v1(20.96,82.84) v1(20.96,82.24) v1(20.96,81.64) v1(20.96,81.04) v1(20.96,80.44) v1(20.96,79.84) v1(20.96,79.24) v1(20.96,78.64) v1(20.96,78.04) v1(20.96,59.44) v1(20.96,58.84) v1(20.96,55.84) v1(20.96,55.24) v1(20.96,54.64) v1(20.96,52.24) v1(20.96,36.04) v1(20.96,33.04) v1(20.96,32.44) v1(20.96,31.84) v1(20.96,31.24) v1(20.96,30.64) v1(20.96,25.24) v1(20.96,14.44) v1(20.96,7.84) v1(20.96,7.24) v1(20.96,6.64) v1(20.96,6.04) v1(20.96,4.24) v1(20.96,3.64) v1(20.96,3.04) v1(20.96,2.44) v1(20.96,1.84) v1(20.96,1.24) v1(20.96,0.64) v1(21.56,93.64) v1(21.56,93.04) v1(21.56,92.44) v1(21.56,91.84) v1(21.56,91.24) v1(21.56,90.64) v1(21.56,40.24) v1(21.56,37.84) v1(21.56,37.24) v1(21.56,32.44) v1(21.56,31.84) v1(21.56,31.24) v1(21.56,30.64) v1(21.56,30.04) v1(21.56,25.84) v1(21.56,25.24) v1(21.56,24.64) v1(21.56,22.24) v1(21.56,21.64) v1(21.56,21.04) v1(21.56,14.44) v1(21.56,7.84) v1(21.56,7.24) v1(21.56,6.64) v1(21.56,6.04) v1(21.56,1.24) v1(21.56,0.64) v1(21.93,44.25) v1(22.16,93.64) v1(22.16,93.04) v1(22.16,92.44) v1(22.16,91.84) v1(22.16,91.24) v1(22.16,40.24) v1(22.16,37.84) v1(22.16,37.24) v1(22.16,36.64) v1(22.16,32.44) v1(22.16,31.84) v1(22.16,31.24) v1(22.16,30.64) v1(22.16,30.04) v1(22.16,29.44) v1(22.16,28.84) v1(22.16,28.24) v1(22.16,27.64) v1(22.16,27.04) v1(22.16,26.44) v1(22.16,25.84) v1(22.16,25.24) v1(22.16,24.64) v1(22.16,24.04) v1(22.16,21.64) v1(22.16,21.04) v1(22.16,14.44) v1(22.16,10.84) v1(22.16,10.24) v1(22.16,9.64) v1(22.16,1.24) v1(22.16,0.64) v1(22.76,93.64) v1(22.76,93.04) v1(22.76,92.44) v1(22.76,91.84) v1(22.76,40.24) v1(22.76,37.84) v1(22.76,37.24) v1(22.76,36.64) v1(22.76,36.04) v1(22.76,32.44) v1(22.76,31.84) v1(22.76,31.24) v1(22.76,30.64) v1(22.76,30.04) v1(22.76,29.44) v1(22.76,28.84) v1(22.76,28.24) v1(22.76,27.64) v1(22.76,27.04) v1(22.76,26.44) v1(22.76,25.84) v1(22.76,25.24) v1(22.76,24.64) v1(22.76,24.04) v1(22.76,23.44) v1(22.76,21.04) v1(22.76,15.04) v1(22.76,14.44) v1(22.76,10.84) v1(22.76,10.24) v1(22.76,9.64) v1(22.72,7.71) v1(22.76,1.24) v1(22.76,0.64) v1(23.36,93.64) v1(23.36,93.04) v1(23.36,92.44) v1(23.36,88.84) v1(23.36,88.24) v1(23.36,87.64) v1(23.36,87.04) v1(23.36,86.44) v1(23.36,85.84) v1(23.36,52.24) v1(23.36,37.84) v1(23.36,37.24) v1(23.36,36.64) v1(23.36,36.04) v1(23.36,35.44) v1(23.36,31.84) v1(23.36,31.24) v1(23.36,30.64) v1(23.36,30.04) v1(23.36,29.44) v1(23.36,28.84) v1(23.36,28.24) v1(23.36,27.64) v1(23.36,27.04) v1(23.36,26.44) v1(23.36,25.84) v1(23.36,25.24) v1(23.36,24.64) v1(23.36,24.04) v1(23.36,23.44) v1(23.36,22.84) v1(23.32,16.05) v1(23.36,15.04) v1(23.36,14.44) v1(23.36,10.84) v1(23.36,10.24) v1(23.36,9.64) v1(23.36,1.24) v1(23.36,0.64) v1(23.96,93.64) v1(23.96,93.04) v1(23.96,89.44) v1(23.96,88.84) v1(23.96,88.24) v1(23.96,87.64) v1(23.96,87.04) v1(23.96,86.44) v1(23.96,58.84) v1(23.96,58.24) v1(23.96,37.84) v1(23.96,37.24) v1(23.96,36.64) v1(23.96,36.04) v1(23.96,35.44) v1(23.96,32.44) v1(23.96,31.84) v1(23.96,31.24) v1(23.96,30.64) v1(23.96,30.04) v1(23.96,29.44) v1(23.96,28.84) v1(23.96,28.24) v1(23.96,27.64) v1(23.96,27.04) v1(23.96,26.44) v1(23.96,25.84) v1(23.96,25.24) v1(23.96,24.64) v1(23.96,24.04) v1(23.96,23.44) v1(23.96,22.84) v1(23.96,22.24) v1(23.96,15.04) v1(23.96,14.44) v1(23.96,7.84) v1(23.96,7.24) v1(23.96,6.64) v1(23.96,6.04) v1(23.96,1.24) v1(23.96,0.64) v1(24.37,10.28) v1(24.47,2.54) v1(24.56,93.64) v1(24.56,93.04) v1(24.56,90.04) v1(24.56,89.44) v1(24.56,88.84) v1(24.56,88.24) v1(24.56,87.64) v1(24.56,87.04) v1(24.56,42.64) v1(24.56,42.04) v1(24.56,41.44) v1(24.56,40.84) v1(24.56,40.24) v1(24.56,37.84) v1(24.56,37.24) v1(24.56,36.64) v1(24.56,36.04) v1(24.56,35.44) v1(24.56,32.44) v1(24.56,31.84) v1(24.56,31.24) v1(24.56,30.64) v1(24.56,30.04) v1(24.56,29.44) v1(24.56,28.84) v1(24.56,28.24) v1(24.56,27.64) v1(24.56,27.04) v1(24.56,26.44) v1(24.56,25.84) v1(24.56,25.24) v1(24.56,24.64) v1(24.56,24.04) v1(24.56,23.44) v1(24.56,22.84) v1(24.56,22.24) v1(24.56,21.64) v1(24.56,16.24) v1(24.56,15.64) v1(24.56,15.04) v1(24.56,1.24) v1(24.56,0.64) v1(25.16,93.64) v1(25.16,93.04) v1(25.16,90.04) v1(25.16,89.44) v1(25.16,88.84) v1(25.16,88.24) v1(25.16,87.64) v1(25.16,45.64) v1(25.16,45.04) v1(25.16,44.44) v1(25.16,43.84) v1(25.16,43.24) v1(25.16,42.64) v1(25.16,42.04) v1(25.16,41.44) v1(25.16,40.84) v1(25.16,40.24) v1(25.16,37.84) v1(25.16,37.24) v1(25.16,36.64) v1(25.16,36.04) v1(25.16,35.44) v1(25.16,32.44) v1(25.16,31.84) v1(25.16,31.24) v1(25.16,30.64) v1(25.16,30.04) v1(25.16,29.44) v1(25.16,28.84) v1(25.16,28.24) v1(25.16,27.64) v1(25.16,27.04) v1(25.16,26.44) v1(25.16,25.84) v1(25.16,25.24) v1(25.16,24.64) v1(25.16,24.04) v1(25.16,23.44) v1(25.16,22.84) v1(25.16,22.24) v1(25.16,21.64) v1(25.16,16.24) v1(25.16,1.24) v1(25.16,0.64) v1(25.38,58.19) v1(25.48,15.3) v1(25.76,93.64) v1(25.76,90.04) v1(25.76,89.44) v1(25.76,88.84) v1(25.76,88.24) v1(25.76,51.04) v1(25.76,49.24) v1(25.76,45.64) v1(25.76,45.04) v1(25.76,44.44) v1(25.76,43.84) v1(25.76,43.24) v1(25.76,42.64) v1(25.76,42.04) v1(25.76,41.44) v1(25.76,40.84) v1(25.76,40.24) v1(25.76,37.84) v1(25.76,18.04) v1(25.76,16.24) v1(25.76,1.24) v1(25.76,0.64) v1(26.16,58.19) v1(26.36,93.64) v1(26.36,89.44) v1(26.36,88.84) v1(26.36,45.64) v1(26.36,45.04) v1(26.36,44.44) v1(26.36,43.84) v1(26.36,43.24) v1(26.36,42.64) v1(26.36,42.04) v1(26.36,41.44) v1(26.36,40.84) v1(26.36,40.24) v1(26.36,37.84) v1(26.36,19.24) v1(26.36,18.64) v1(26.36,18.04) v1(26.36,16.24) v1(26.36,10.84) v1(26.36,10.24) v1(26.36,9.64) v1(26.36,7.84) v1(26.36,1.24) v1(26.36,0.64) v1(26.9,58.19) v1(26.96,93.64) v1(26.96,89.44) v1(26.96,45.64) v1(26.96,45.04) v1(26.96,44.44) v1(26.96,42.04) v1(26.96,41.44) v1(26.96,40.84) v1(26.96,40.24) v1(26.96,19.24) v1(26.96,18.64) v1(26.96,18.04) v1(26.96,16.24) v1(26.96,15.64) v1(26.96,15.04) v1(26.96,14.44) v1(26.96,13.84) v1(26.96,13.24) v1(26.96,12.64) v1(26.96,12.04) v1(26.96,10.84) v1(26.96,10.24) v1(26.96,7.84) v1(26.96,5.44) v1(26.96,1.24) v1(26.96,0.64) v1(27.56,93.64) v1(27.56,42.04) v1(27.56,41.44) v1(27.56,40.84) v1(27.56,40.24) v1(27.56,19.24) v1(27.56,18.64) v1(27.56,18.04) v1(27.56,16.24) v1(27.56,15.64) v1(27.56,15.04) v1(27.56,14.44) v1(27.56,13.84) v1(27.56,13.24) v1(27.56,12.64) v1(27.56,12.04) v1(27.56,10.84) v1(27.56,8.44) v1(27.56,7.84) v1(27.56,5.44) v1(27.56,3.64) v1(27.56,3.04) v1(27.56,2.44) v1(27.56,1.84) v1(27.56,1.24) v1(27.56,0.64) v1(28.16,93.64) v1(28.16,57.64) v1(28.16,49.84) v1(28.16,41.44) v1(28.16,33.04) v1(28.16,32.44) v1(28.16,31.84) v1(28.16,31.24) v1(28.16,22.84) v1(28.16,22.24) v1(28.16,21.64) v1(28.16,19.24) v1(28.16,18.64) v1(28.16,18.04) v1(28.16,16.24) v1(28.16,15.64) v1(28.16,15.04) v1(28.16,14.44) v1(28.16,13.84) v1(28.16,13.24) v1(28.16,12.64) v1(28.16,12.04) v1(28.16,9.04) v1(28.16,8.44) v1(28.16,7.84) v1(28.16,5.44) v1(28.16,3.64) v1(28.16,3.04) v1(28.16,2.44) v1(28.16,1.84) v1(28.16,1.24) v1(28.16,0.64) v1(28.27,58.14) v1(28.76,93.64) v1(28.76,93.04) v1(28.76,70.84) v1(28.76,70.24) v1(28.76,58.24) v1(28.76,57.64) v1(28.76,49.84) v1(28.76,42.04) v1(28.76,41.44) v1(28.76,19.24) v1(28.76,18.64) v1(28.76,18.04) v1(28.76,16.24) v1(28.76,15.64) v1(28.76,15.04) v1(28.76,14.44) v1(28.76,13.84) v1(28.76,13.24) v1(28.76,12.64) v1(28.76,12.04) v1(28.76,9.64) v1(28.76,9.04) v1(28.76,8.44) v1(28.76,7.84) v1(28.76,5.44) v1(28.76,3.64) v1(28.76,3.04) v1(28.76,2.44) v1(28.76,1.84) v1(28.76,1.24) v1(28.76,0.64) v1(29.36,93.64) v1(29.36,93.04) v1(29.36,42.04) v1(29.36,41.44) v1(29.36,19.24) v1(29.36,18.64) v1(29.36,18.04) v1(29.36,16.24) v1(29.36,15.64) v1(29.36,15.04) v1(29.36,14.44) v1(29.36,13.84) v1(29.36,13.24) v1(29.36,12.64) v1(29.36,10.24) v1(29.36,9.64) v1(29.36,9.04) v1(29.36,8.44) v1(29.36,7.84) v1(29.36,5.44) v1(29.36,3.64) v1(29.36,3.04) v1(29.36,2.44) v1(29.36,1.84) v1(29.36,1.24) v1(29.36,0.64) v1(29.96,93.64) v1(29.96,93.04) v1(29.96,92.44) v1(29.96,74.44) v1(29.96,72.04) v1(29.96,71.44) v1(29.96,41.44) v1(29.96,37.84) v1(29.96,21.64) v1(29.96,19.24) v1(29.96,18.64) v1(29.96,18.04) v1(29.96,16.24) v1(29.96,15.64) v1(29.96,15.04) v1(29.96,14.44) v1(29.96,13.84) v1(29.96,13.24) v1(29.96,10.84) v1(29.96,10.24) v1(29.96,9.64) v1(29.96,9.04) v1(29.96,8.44) v1(29.96,7.84) v1(29.96,5.44) v1(29.96,3.64) v1(29.96,3.04) v1(29.96,2.44) v1(29.96,1.84) v1(29.96,1.24) v1(29.96,0.64) v1(30.56,93.64) v1(30.56,93.04) v1(30.56,74.44) v1(30.56,72.04) v1(30.56,71.44) v1(30.56,41.44) v1(30.56,37.84) v1(30.56,37.24) v1(30.56,36.64) v1(30.56,36.04) v1(30.56,21.64) v1(30.56,19.24) v1(30.56,18.64) v1(30.56,18.04) v1(30.56,16.24) v1(30.56,15.64) v1(30.56,15.04) v1(30.56,14.44) v1(30.56,13.84) v1(30.56,11.44) v1(30.56,10.84) v1(30.56,10.24) v1(30.56,9.64) v1(30.56,9.04) v1(30.56,8.44) v1(30.56,7.84) v1(30.56,5.44) v1(30.56,3.64) v1(30.56,3.04) v1(30.56,2.44) v1(30.56,1.84) v1(30.56,1.24) v1(30.56,0.64) v1(30.62,22.58) v1(31.16,93.64) v1(31.16,41.44) v1(31.16,38.44) v1(31.16,37.84) v1(31.16,37.24) v1(31.16,36.64) v1(31.16,36.04) v1(31.16,35.44) v1(31.16,34.84) v1(31.16,34.24) v1(31.16,33.64) v1(31.16,21.64) v1(31.16,19.24) v1(31.16,18.64) v1(31.16,18.04) v1(31.16,16.24) v1(31.16,15.64) v1(31.16,15.04) v1(31.16,14.44) v1(31.16,12.04) v1(31.16,11.44) v1(31.16,10.84) v1(31.16,10.24) v1(31.16,9.64) v1(31.16,9.04) v1(31.16,8.44) v1(31.16,7.84) v1(31.16,5.44) v1(31.16,3.64) v1(31.16,3.04) v1(31.16,2.44) v1(31.16,1.84) v1(31.16,1.24) v1(31.16,0.64) v1(31.22,74.88) v1(31.57,75.66) v1(31.67,71.33) v1(31.76,88.24) v1(31.76,45.04) v1(31.76,41.44) v1(31.76,37.84) v1(31.76,37.24) v1(31.76,19.24) v1(31.76,18.64) v1(31.76,16.24) v1(31.76,15.64) v1(31.76,15.04) v1(31.76,14.44) v1(31.76,12.04) v1(31.76,11.44) v1(31.76,10.24) v1(31.76,9.64) v1(31.76,9.04) v1(31.76,8.44) v1(31.76,7.84) v1(31.76,5.44) v1(31.76,3.64) v1(31.76,3.04) v1(31.76,2.44) v1(31.76,1.84) v1(31.76,1.24) v1(31.76,0.64) v1(32.36,67.24) v1(32.36,45.64) v1(32.36,45.04) v1(32.36,44.44) v1(32.36,43.84) v1(32.36,43.24) v1(32.36,42.64) v1(32.36,42.04) v1(32.36,41.44) v1(32.36,37.84) v1(32.36,19.24) v1(32.36,16.84) v1(32.36,16.24) v1(32.36,15.64) v1(32.36,15.04) v1(32.36,14.44) v1(32.36,12.04) v1(32.36,9.64) v1(32.36,9.04) v1(32.36,8.44) v1(32.36,7.84) v1(32.36,5.44) v1(32.36,3.64) v1(32.36,3.04) v1(32.36,2.44) v1(32.36,1.84) v1(32.36,1.24) v1(32.36,0.64) v1(32.96,71.44) v1(32.96,70.84) v1(32.96,67.24) v1(32.96,45.64) v1(32.96,45.04) v1(32.96,44.44) v1(32.96,43.84) v1(32.96,43.24) v1(32.96,42.64) v1(32.96,42.04) v1(32.96,41.44) v1(32.96,17.44) v1(32.96,16.84) v1(32.96,16.24) v1(32.96,15.64) v1(32.96,15.04) v1(32.96,14.44) v1(32.96,12.04) v1(32.96,9.04) v1(32.96,8.44) v1(32.96,7.84) v1(32.96,5.44) v1(32.96,3.64) v1(32.96,3.04) v1(32.96,2.44) v1(32.96,1.84) v1(32.96,1.24) v1(32.96,0.64) v1(33.56,67.24) v1(33.56,45.64) v1(33.56,45.04) v1(33.56,44.44) v1(33.56,43.84) v1(33.56,43.24) v1(33.56,42.64) v1(33.56,42.04) v1(33.56,41.44) v1(33.56,21.04) v1(33.56,20.44) v1(33.56,18.04) v1(33.56,17.44) v1(33.56,16.84) v1(33.56,16.24) v1(33.56,15.64) v1(33.56,15.04) v1(33.56,14.44) v1(33.56,12.04) v1(33.56,9.64) v1(33.56,9.04) v1(33.56,8.44) v1(33.56,7.84) v1(33.56,5.44) v1(33.56,3.64) v1(33.56,3.04) v1(33.56,2.44) v1(33.56,1.84) v1(33.56,1.24) v1(33.56,0.64) v1(34.07,71.16) v1(34.16,35.44) v1(34.16,34.84) v1(34.16,24.64) v1(34.16,24.04) v1(34.16,23.44) v1(34.16,21.64) v1(34.16,21.04) v1(34.16,18.04) v1(34.16,17.44) v1(34.16,16.84) v1(34.16,16.24) v1(34.16,15.64) v1(34.16,15.04) v1(34.16,14.44) v1(34.16,12.04) v1(34.16,11.44) v1(34.16,10.84) v1(34.16,10.24) v1(34.16,9.64) v1(34.16,9.04) v1(34.16,8.44) v1(34.16,7.84) v1(34.16,5.44) v1(34.16,3.64) v1(34.16,3.04) v1(34.16,2.44) v1(34.16,1.84) v1(34.16,1.24) v1(34.16,0.64) v1(34.62,67.06) v1(34.76,52.84) v1(34.76,52.24) v1(34.76,51.64) v1(34.76,51.04) v1(34.76,34.84) v1(34.76,34.24) v1(34.76,24.64) v1(34.76,24.04) v1(34.76,23.44) v1(34.76,21.64) v1(34.76,18.04) v1(34.76,17.44) v1(34.76,16.84) v1(34.76,16.24) v1(34.76,15.64) v1(34.76,15.04) v1(34.76,14.44) v1(34.76,5.44) v1(34.76,3.64) v1(34.76,3.04) v1(34.76,2.44) v1(34.76,1.84) v1(34.76,1.24) v1(34.76,0.64) v1(35.2,71.16) v1(35.36,45.64) v1(35.36,42.64) v1(35.36,42.04) v1(35.36,24.64) v1(35.36,24.04) v1(35.36,23.44) v1(35.36,19.84) v1(35.36,18.04) v1(35.36,17.44) v1(35.36,16.84) v1(35.36,16.24) v1(35.36,15.64) v1(35.36,15.04) v1(35.36,14.44) v1(35.36,3.64) v1(35.36,3.04) v1(35.36,2.44) v1(35.36,1.84) v1(35.36,1.24) v1(35.36,0.64) v1(35.64,39.76) v1(35.96,42.64) v1(35.97,34.41) v1(35.96,24.64) v1(35.96,24.04) v1(35.96,23.44) v1(35.96,20.44) v1(35.96,19.84) v1(35.96,17.44) v1(35.96,16.84) v1(35.96,16.24) v1(35.96,15.64) v1(35.96,15.04) v1(35.96,12.04) v1(35.96,11.44) v1(35.96,10.84) v1(35.96,10.24) v1(35.96,9.64) v1(35.96,3.64) v1(35.96,3.04) v1(35.96,2.44) v1(35.96,1.84) v1(35.96,1.24) v1(35.96,0.64) v1(36.12,43.58) v1(36.56,93.64) v1(36.56,90.04) v1(36.56,89.44) v1(36.56,24.64) v1(36.56,24.04) v1(36.56,23.44) v1(36.56,21.04) v1(36.56,20.44) v1(36.56,19.84) v1(36.56,18.04) v1(36.56,17.44) v1(36.56,16.84) v1(36.56,16.24) v1(36.56,15.64) v1(36.56,15.04) v1(36.56,11.44) v1(36.56,10.84) v1(36.56,10.24) v1(36.56,3.64) v1(36.56,3.04) v1(36.56,2.44) v1(36.56,1.84) v1(36.56,1.24) v1(36.56,0.64) v1(37.16,93.64) v1(37.16,93.04) v1(37.16,92.44) v1(37.16,91.84) v1(37.16,91.24) v1(37.16,90.64) v1(37.16,90.04) v1(37.16,89.44) v1(37.16,88.84) v1(37.16,54.04) v1(37.16,53.44) v1(37.16,34.84) v1(37.16,34.24) v1(37.16,25.24) v1(37.16,24.64) v1(37.16,24.04) v1(37.16,20.44) v1(37.16,19.84) v1(37.16,18.04) v1(37.16,17.44) v1(37.16,16.84) v1(37.16,16.24) v1(37.16,15.64) v1(37.16,15.04) v1(37.16,11.44) v1(37.16,10.84) v1(37.16,10.24) v1(37.16,3.64) v1(37.16,3.04) v1(37.16,2.44) v1(37.16,1.84) v1(37.16,1.24) v1(37.16,0.64) v1(37.64,40.69) v1(37.76,93.64) v1(37.76,93.04) v1(37.76,92.44) v1(37.76,91.84) v1(37.76,91.24) v1(37.76,90.64) v1(37.76,90.04) v1(37.76,89.44) v1(37.76,88.84) v1(37.76,88.24) v1(37.76,29.44) v1(37.76,28.84) v1(37.76,28.24) v1(37.76,27.64) v1(37.76,27.04) v1(37.76,26.44) v1(37.76,25.84) v1(37.76,25.24) v1(37.76,24.64) v1(37.76,22.24) v1(37.76,19.84) v1(37.76,18.04) v1(37.76,17.44) v1(37.76,16.84) v1(37.76,16.24) v1(37.76,15.64) v1(37.76,15.04) v1(37.76,14.44) v1(37.76,12.04) v1(37.76,11.44) v1(37.76,10.84) v1(37.76,7.24) v1(37.76,3.64) v1(37.76,3.04) v1(37.76,2.44) v1(37.76,1.84) v1(37.76,1.24) v1(37.76,0.64) v1(38.36,93.64) v1(38.36,93.04) v1(38.36,92.44) v1(38.36,91.84) v1(38.36,91.24) v1(38.36,90.64) v1(38.36,90.04) v1(38.36,89.44) v1(38.36,88.84) v1(38.36,88.24) v1(38.36,87.64) v1(38.36,22.84) v1(38.36,22.24) v1(38.36,21.64) v1(38.36,8.44) v1(38.36,7.84) v1(38.36,7.24) v1(38.36,6.64) v1(38.36,6.04) v1(38.36,3.64) v1(38.36,3.04) v1(38.36,2.44) v1(38.36,1.84) v1(38.36,1.24) v1(38.36,0.64) v1(38.96,93.64) v1(38.96,93.04) v1(38.96,92.44) v1(38.96,91.84) v1(38.96,91.24) v1(38.96,90.64) v1(38.96,90.04) v1(38.96,89.44) v1(38.96,88.84) v1(38.96,88.24) v1(38.96,87.64) v1(38.96,87.04) v1(38.96,81.04) v1(38.96,80.44) v1(38.96,79.84) v1(38.96,79.24) v1(38.96,78.64) v1(38.96,78.04) v1(38.96,67.24) v1(38.96,66.64) v1(38.96,23.44) v1(38.96,22.84) v1(38.96,22.24) v1(38.96,21.64) v1(38.96,21.04) v1(38.96,9.04) v1(38.96,8.44) v1(38.96,7.84) v1(38.96,7.24) v1(38.96,6.64) v1(38.96,4.24) v1(38.96,3.64) v1(38.96,3.04) v1(38.96,2.44) v1(38.96,1.84) v1(38.96,1.24) v1(38.96,0.64) v1(39.2,71.16) v1(39.56,93.64) v1(39.56,93.04) v1(39.56,92.44) v1(39.56,91.84) v1(39.56,91.24) v1(39.56,90.64) v1(39.56,90.04) v1(39.56,89.44) v1(39.56,88.84) v1(39.56,88.24) v1(39.56,87.64) v1(39.56,87.04) v1(39.56,81.04) v1(39.56,80.44) v1(39.56,79.84) v1(39.56,79.24) v1(39.56,78.64) v1(39.56,78.04) v1(39.56,67.24) v1(39.56,66.64) v1(39.56,55.84) v1(39.56,55.24) v1(39.56,54.64) v1(39.56,46.24) v1(39.56,30.04) v1(39.56,29.44) v1(39.56,28.84) v1(39.56,28.24) v1(39.56,27.64) v1(39.56,27.04) v1(39.56,26.44) v1(39.56,25.84) v1(39.56,25.24) v1(39.56,22.24) v1(39.56,21.64) v1(39.56,21.04) v1(39.56,20.44) v1(39.56,19.84) v1(39.56,19.24) v1(39.56,16.84) v1(39.56,16.24) v1(39.56,15.64) v1(39.56,15.04) v1(39.56,14.44) v1(39.56,13.84) v1(39.56,13.24) v1(39.56,12.64) v1(39.56,12.04) v1(39.56,9.64) v1(39.56,9.04) v1(39.56,8.44) v1(39.56,7.84) v1(39.56,7.24) v1(39.56,4.84) v1(39.56,4.24) v1(39.56,3.64) v1(39.56,3.04) v1(39.56,2.44) v1(39.56,1.84) v1(39.56,1.24) v1(39.56,0.64) v1(40.08,66.73) v1(40.16,93.64) v1(40.16,93.04) v1(40.16,92.44) v1(40.16,91.84) v1(40.16,91.24) v1(40.16,90.64) v1(40.16,90.04) v1(40.16,89.44) v1(40.16,88.84) v1(40.16,88.24) v1(40.16,87.64) v1(40.16,87.04) v1(40.16,80.44) v1(40.16,79.84) v1(40.16,79.24) v1(40.16,78.64) v1(40.16,78.04) v1(40.16,67.24) v1(40.16,66.04) v1(40.16,63.64) v1(40.16,55.84) v1(40.16,55.24) v1(40.16,54.64) v1(40.16,46.24) v1(40.16,45.64) v1(40.16,30.04) v1(40.16,29.44) v1(40.16,28.84) v1(40.16,28.24) v1(40.16,27.64) v1(40.16,27.04) v1(40.16,26.44) v1(40.16,25.84) v1(40.16,21.64) v1(40.16,21.04) v1(40.16,20.44) v1(40.16,19.84) v1(40.16,19.24) v1(40.16,16.24) v1(40.16,15.64) v1(40.16,15.04) v1(40.16,14.44) v1(40.16,13.84) v1(40.16,13.24) v1(40.16,12.64) v1(40.16,12.04) v1(40.16,9.64) v1(40.16,9.04) v1(40.16,8.44) v1(40.16,7.84) v1(40.16,5.44) v1(40.16,4.84) v1(40.16,4.24) v1(40.16,3.64) v1(40.16,3.04) v1(40.16,2.44) v1(40.16,1.84) v1(40.16,1.24) v1(40.16,0.64) v1(40.7,36.73) v1(40.76,93.64) v1(40.76,93.04) v1(40.76,92.44) v1(40.76,91.84) v1(40.76,91.24) v1(40.76,90.64) v1(40.76,90.04) v1(40.76,89.44) v1(40.76,88.84) v1(40.76,88.24) v1(40.76,87.64) v1(40.76,67.24) v1(40.76,66.64) v1(40.76,66.04) v1(40.76,63.64) v1(40.76,55.84) v1(40.76,55.24) v1(40.76,54.64) v1(40.76,38.44) v1(40.76,30.04) v1(40.76,27.04) v1(40.76,26.44) v1(40.76,25.84) v1(40.76,21.04) v1(40.76,20.44) v1(40.76,19.84) v1(40.76,19.24) v1(40.76,18.64) v1(40.76,15.64) v1(40.76,15.04) v1(40.76,14.44) v1(40.76,13.84) v1(40.76,13.24) v1(40.76,12.64) v1(40.76,12.04) v1(40.76,9.64) v1(40.76,9.04) v1(40.76,8.44) v1(40.76,6.04) v1(40.76,5.44) v1(40.76,4.84) v1(40.76,4.24) v1(40.76,3.64) v1(40.76,3.04) v1(40.76,2.44) v1(40.76,1.84) v1(41.36,93.64) v1(41.36,93.04) v1(41.36,92.44) v1(41.36,91.84) v1(41.36,91.24) v1(41.36,90.64) v1(41.36,90.04) v1(41.36,89.44) v1(41.36,88.84) v1(41.36,88.24) v1(41.36,30.04) v1(41.39,28.69) v1(41.39,27.98) v1(41.36,27.04) v1(41.36,26.44) v1(41.36,25.84) v1(41.36,15.04) v1(41.36,14.44) v1(41.36,13.84) v1(41.36,13.24) v1(41.36,12.64) v1(41.36,12.04) v1(41.36,9.64) v1(41.36,9.04) v1(41.36,6.64) v1(41.36,6.04) v1(41.36,5.44) v1(41.6,3.43) v1(41.96,93.64) v1(41.96,93.04) v1(41.96,92.44) v1(41.96,91.84) v1(41.96,91.24) v1(41.96,90.64) v1(41.96,90.04) v1(41.96,89.44) v1(41.96,88.84) v1(41.96,32.44) v1(41.96,31.84) v1(41.96,31.24) v1(41.96,30.64) v1(41.96,30.04) v1(41.96,18.04) v1(41.96,17.44) v1(41.96,7.24) v1(41.96,6.64) v1(41.96,6.04) v1(41.96,5.44) v1(42.14,71.3) v1(42.39,28.91) v1(42.4,27.98) v1(42.56,93.64) v1(42.56,93.04) v1(42.56,92.44) v1(42.56,91.84) v1(42.56,91.24) v1(42.56,90.64) v1(42.56,90.04) v1(42.56,89.44) v1(42.56,85.84) v1(42.56,85.24) v1(42.56,84.64) v1(42.56,84.04) v1(42.56,83.44) v1(42.56,78.04) v1(42.56,32.44) v1(42.56,30.64) v1(42.56,30.04) v1(42.56,16.24) v1(42.56,7.84) v1(42.56,7.24) v1(42.56,6.64) v1(42.56,6.04) v1(42.56,5.44) v1(42.56,1.84) v1(43,37.16) v1(42.99,31.9) v1(42.99,31.16) v1(42.92,17.63) v1(43.16,93.64) v1(43.16,93.04) v1(43.16,92.44) v1(43.16,91.84) v1(43.16,91.24) v1(43.16,90.64) v1(43.16,90.04) v1(43.16,86.44) v1(43.16,85.84) v1(43.16,85.24) v1(43.16,84.64) v1(43.16,84.04) v1(43.16,83.44) v1(43.16,82.84) v1(43.16,64.84) v1(43.16,64.24) v1(43.16,63.64) v1(43.16,55.84) v1(43.16,55.24) v1(43.16,54.64) v1(43.16,54.04) v1(43.16,53.44) v1(43.16,52.84) v1(43.16,45.04) v1(43.16,42.64) v1(43.16,30.64) v1(43.16,30.04) v1(43.16,16.24) v1(43.16,15.64) v1(43.16,15.04) v1(43.16,14.44) v1(43.16,13.84) v1(43.16,13.24) v1(43.16,12.64) v1(43.16,12.04) v1(43.16,11.44) v1(43.16,10.84) v1(43.16,10.24) v1(43.16,9.64) v1(43.16,9.04) v1(43.16,8.44) v1(43.16,7.84) v1(43.16,7.24) v1(43.16,6.64) v1(43.16,6.04) v1(43.16,5.44) v1(43.16,4.84) v1(43.16,4.24) v1(43.16,3.64) v1(43.16,3.04) v1(43.16,2.44) v1(43.16,1.84) v1(43.76,93.64) v1(43.76,93.04) v1(43.76,92.44) v1(43.76,91.84) v1(43.76,91.24) v1(43.76,90.64) v1(43.76,87.04) v1(43.76,86.44) v1(43.76,85.84) v1(43.76,85.24) v1(43.76,84.64) v1(43.76,84.04) v1(43.76,83.44) v1(43.76,82.84) v1(43.76,82.24) v1(43.76,65.44) v1(43.76,64.84) v1(43.76,64.24) v1(43.76,63.64) v1(43.76,56.44) v1(43.76,55.84) v1(43.76,55.24) v1(43.76,54.64) v1(43.76,54.04) v1(43.76,53.44) v1(43.76,52.84) v1(43.76,42.64) v1(43.76,42.04) v1(43.76,17.44) v1(43.76,16.84) v1(43.76,16.24) v1(43.76,15.64) v1(43.76,15.04) v1(43.76,14.44) v1(43.76,13.84) v1(43.76,13.24) v1(43.76,12.64) v1(43.76,12.04) v1(43.76,11.44) v1(43.76,10.84) v1(43.76,10.24) v1(43.76,9.64) v1(43.76,9.04) v1(43.76,8.44) v1(43.76,7.84) v1(43.76,7.24) v1(43.76,6.64) v1(43.76,6.04) v1(43.76,5.44) v1(44.36,93.64) v1(44.36,93.04) v1(44.36,92.44) v1(44.36,91.84) v1(44.36,91.24) v1(44.36,87.64) v1(44.36,87.04) v1(44.36,86.44) v1(44.36,85.84) v1(44.36,85.24) v1(44.36,84.64) v1(44.36,84.04) v1(44.36,83.44) v1(44.36,82.84) v1(44.36,82.24) v1(44.36,77.44) v1(44.36,72.64) v1(44.36,72.04) v1(44.36,71.44) v1(44.36,70.84) v1(44.36,70.24) v1(44.36,66.64) v1(44.36,66.04) v1(44.36,65.44) v1(44.36,64.84) v1(44.36,64.24) v1(44.36,63.64) v1(44.36,63.04) v1(44.36,57.04) v1(44.36,56.44) v1(44.36,55.84) v1(44.36,55.24) v1(44.36,54.64) v1(44.36,54.04) v1(44.36,53.44) v1(44.36,52.84) v1(44.33,43.69) v1(44.36,42.64) v1(44.36,42.04) v1(44.36,21.04) v1(44.36,20.44) v1(44.36,16.84) v1(44.36,16.24) v1(44.36,15.64) v1(44.36,15.04) v1(44.36,14.44) v1(44.36,13.84) v1(44.36,13.24) v1(44.36,12.64) v1(44.36,12.04) v1(44.36,11.44) v1(44.36,10.84) v1(44.36,10.24) v1(44.36,9.64) v1(44.36,9.04) v1(44.36,8.44) v1(44.36,7.84) v1(44.36,7.24) v1(44.36,6.64) v1(44.36,6.04) v1(44.36,5.44) v1(44.96,93.64) v1(44.96,93.04) v1(44.96,92.44) v1(44.96,88.24) v1(44.96,87.64) v1(44.96,87.04) v1(44.96,86.44) v1(44.96,85.84) v1(44.96,85.24) v1(44.96,84.64) v1(44.96,84.04) v1(44.96,83.44) v1(44.96,82.84) v1(44.96,82.24) v1(44.96,77.44) v1(44.96,76.84) v1(44.96,76.24) v1(44.96,75.64) v1(44.96,72.64) v1(44.96,72.04) v1(44.96,71.44) v1(44.96,70.84) v1(44.96,70.24) v1(44.96,66.64) v1(44.96,66.04) v1(44.96,65.44) v1(44.96,64.84) v1(44.96,64.24) v1(44.96,63.64) v1(44.96,63.04) v1(44.96,62.44) v1(44.96,61.84) v1(44.96,61.24) v1(44.96,60.64) v1(44.96,58.84) v1(44.96,58.24) v1(44.96,57.64) v1(44.96,57.04) v1(44.96,56.44) v1(44.96,55.84) v1(44.96,55.24) v1(44.96,54.64) v1(44.96,54.04) v1(44.96,53.44) v1(44.96,52.84) v1(44.96,42.64) v1(44.96,42.04) v1(44.96,38.44) v1(44.96,37.84) v1(44.96,37.24) v1(44.96,36.64) v1(44.96,30.64) v1(44.96,30.04) v1(44.96,27.04) v1(44.96,26.44) v1(44.96,25.84) v1(44.96,16.24) v1(44.96,15.64) v1(44.96,15.04) v1(44.96,14.44) v1(44.96,13.84) v1(44.96,13.24) v1(44.96,12.64) v1(44.96,12.04) v1(44.96,11.44) v1(44.96,10.84) v1(44.96,10.24) v1(44.96,9.64) v1(44.96,9.04) v1(44.96,8.44) v1(44.96,7.84) v1(44.96,7.24) v1(44.96,6.64) v1(44.96,6.04) v1(44.96,5.44) v1(45.56,93.64) v1(45.56,88.84) v1(45.56,88.24) v1(45.56,87.64) v1(45.56,87.04) v1(45.56,86.44) v1(45.56,85.84) v1(45.56,85.24) v1(45.56,84.64) v1(45.56,84.04) v1(45.56,83.44) v1(45.56,82.84) v1(45.56,82.24) v1(45.56,70.24) v1(45.56,67.24) v1(45.56,66.64) v1(45.56,66.04) v1(45.56,65.44) v1(45.56,64.84) v1(45.56,64.24) v1(45.56,63.64) v1(45.56,63.04) v1(45.56,62.44) v1(45.56,61.84) v1(45.56,61.24) v1(45.56,60.64) v1(45.56,58.84) v1(45.56,58.24) v1(45.56,57.64) v1(45.56,57.04) v1(45.56,56.44) v1(45.56,55.84) v1(45.56,55.24) v1(45.56,54.64) v1(45.56,54.04) v1(45.56,53.44) v1(45.56,52.84) v1(45.56,52.24) v1(45.56,48.64) v1(45.56,48.04) v1(45.56,42.64) v1(45.56,40.24) v1(45.56,37.84) v1(45.56,37.24) v1(45.56,36.64) v1(45.56,36.04) v1(45.56,35.44) v1(45.56,34.84) v1(45.56,34.24) v1(45.56,33.64) v1(45.56,30.64) v1(45.56,30.04) v1(45.56,27.04) v1(45.56,26.44) v1(45.56,25.84) v1(45.56,15.64) v1(45.56,15.04) v1(45.56,14.44) v1(45.56,9.04) v1(45.56,8.44) v1(45.56,7.84) v1(45.56,7.24) v1(45.56,6.64) v1(45.56,6.04) v1(45.56,5.44) v1(46.16,93.64) v1(46.16,89.44) v1(46.16,88.84) v1(46.16,88.24) v1(46.16,87.64) v1(46.16,87.04) v1(46.16,86.44) v1(46.16,85.84) v1(46.16,85.24) v1(46.16,84.64) v1(46.16,84.04) v1(46.16,83.44) v1(46.16,82.84) v1(46.16,82.24) v1(46.16,70.24) v1(46.16,67.24) v1(46.16,66.64) v1(46.16,66.04) v1(46.16,65.44) v1(46.16,64.84) v1(46.16,64.24) v1(46.16,63.64) v1(46.16,63.04) v1(46.16,62.44) v1(46.16,61.84) v1(46.16,61.24) v1(46.16,60.64) v1(46.16,58.84) v1(46.16,58.24) v1(46.16,57.64) v1(46.16,57.04) v1(46.16,56.44) v1(46.16,55.84) v1(46.16,55.24) v1(46.16,54.64) v1(46.16,54.04) v1(46.16,53.44) v1(46.16,52.84) v1(46.16,52.24) v1(46.16,40.84) v1(46.16,40.24) v1(46.16,39.64) v1(46.16,37.24) v1(46.16,36.64) v1(46.16,36.04) v1(46.16,35.44) v1(46.16,34.84) v1(46.16,34.24) v1(46.16,33.64) v1(46.16,31.24) v1(46.16,30.64) v1(46.16,30.04) v1(46.16,27.04) v1(46.16,26.44) v1(46.16,25.84) v1(46.16,0.64) v1(46.76,93.64) v1(46.76,89.44) v1(46.76,88.84) v1(46.76,88.24) v1(46.76,87.64) v1(46.76,83.44) v1(46.76,82.84) v1(46.76,82.24) v1(46.76,70.24) v1(46.76,67.24) v1(46.76,66.64) v1(46.76,66.04) v1(46.76,65.44) v1(46.76,64.84) v1(46.76,64.24) v1(46.76,63.64) v1(46.76,63.04) v1(46.76,62.44) v1(46.76,61.84) v1(46.76,61.24) v1(46.76,60.64) v1(46.76,58.84) v1(46.76,58.24) v1(46.76,57.64) v1(46.76,57.04) v1(46.76,56.44) v1(46.76,55.84) v1(46.76,55.24) v1(46.76,54.64) v1(46.76,54.04) v1(46.76,53.44) v1(46.76,52.84) v1(46.76,52.24) v1(46.79,51.43) v1(46.79,50.6) v1(46.79,49.74) v1(46.76,41.44) v1(46.76,40.84) v1(46.76,40.24) v1(46.76,39.64) v1(46.76,39.04) v1(46.76,36.64) v1(46.76,36.04) v1(46.76,35.44) v1(46.76,34.84) v1(46.76,34.24) v1(46.76,33.64) v1(46.76,33.04) v1(46.76,31.24) v1(46.76,30.64) v1(46.76,27.04) v1(46.76,26.44) v1(46.76,25.84) v1(46.76,0.64) v1(47.36,93.64) v1(47.36,89.44) v1(47.36,88.84) v1(47.36,88.24) v1(47.36,82.84) v1(47.36,82.24) v1(47.36,70.24) v1(47.36,67.24) v1(47.36,66.64) v1(47.36,66.04) v1(47.36,65.44) v1(47.36,64.84) v1(47.36,64.24) v1(47.36,63.64) v1(47.36,63.04) v1(47.36,62.44) v1(47.36,61.84) v1(47.36,61.24) v1(47.36,60.64) v1(47.36,58.84) v1(47.36,58.24) v1(47.36,57.64) v1(47.36,57.04) v1(47.36,56.44) v1(47.36,55.84) v1(47.36,55.24) v1(47.36,54.64) v1(47.36,54.04) v1(47.36,53.44) v1(47.36,52.84) v1(47.36,52.24) v1(47.36,42.04) v1(47.36,41.44) v1(47.36,40.84) v1(47.36,40.24) v1(47.36,39.64) v1(47.36,39.04) v1(47.36,36.04) v1(47.36,35.44) v1(47.36,34.84) v1(47.36,34.24) v1(47.36,33.64) v1(47.36,31.24) v1(47.36,30.64) v1(47.36,27.04) v1(47.36,26.44) v1(47.36,25.84) v1(47.36,0.64) v1(47.96,93.64) v1(47.96,90.04) v1(47.96,89.44) v1(47.96,88.84) v1(47.96,88.24) v1(47.96,82.84) v1(47.96,82.24) v1(47.96,74.44) v1(47.96,73.84) v1(47.96,73.24) v1(47.96,70.24) v1(47.96,67.24) v1(47.96,66.64) v1(47.96,66.04) v1(47.96,65.44) v1(47.96,64.84) v1(47.96,64.24) v1(47.96,63.64) v1(47.96,63.04) v1(47.96,62.44) v1(47.96,61.84) v1(47.96,61.24) v1(47.96,60.64) v1(47.96,58.84) v1(47.96,58.24) v1(47.96,57.64) v1(47.96,57.04) v1(47.96,56.44) v1(47.96,55.84) v1(47.96,55.24) v1(47.96,54.64) v1(47.96,54.04) v1(47.96,53.44) v1(47.96,52.84) v1(47.96,52.24) v1(47.96,42.04) v1(47.96,41.44) v1(47.96,40.84) v1(47.96,40.24) v1(47.96,39.64) v1(47.96,39.04) v1(47.96,35.44) v1(47.96,34.84) v1(47.96,34.24) v1(47.96,33.64) v1(47.96,30.64) v1(47.96,27.04) v1(47.96,26.44) v1(47.96,25.84) v1(47.96,16.24) v1(47.96,15.64) v1(47.96,15.04) v1(47.96,14.44) v1(47.96,9.04) v1(47.96,8.44) v1(47.96,7.84) v1(47.96,7.24) v1(47.96,6.64) v1(47.96,6.04) v1(47.96,5.44) v1(47.96,4.84) v1(47.96,4.24) v1(47.96,3.64) v1(47.96,3.04) v1(47.96,2.44) v1(47.96,1.84) v1(47.96,1.24) v1(47.96,0.64) v1(48.56,82.84) v1(48.56,82.24) v1(48.56,81.64) v1(48.56,77.44) v1(48.56,76.84) v1(48.56,76.24) v1(48.56,75.64) v1(48.56,75.04) v1(48.56,74.44) v1(48.56,73.84) v1(48.56,73.24) v1(48.56,72.64) v1(48.56,72.04) v1(48.56,71.44) v1(48.56,70.84) v1(48.56,70.24) v1(48.56,67.24) v1(48.56,66.64) v1(48.56,66.04) v1(48.56,65.44) v1(48.56,64.84) v1(48.56,64.24) v1(48.56,63.64) v1(48.56,63.04) v1(48.56,62.44) v1(48.56,61.84) v1(48.56,61.24) v1(48.56,60.64) v1(48.56,58.24) v1(48.56,57.64) v1(48.56,57.04) v1(48.56,56.44) v1(48.56,55.84) v1(48.56,55.24) v1(48.56,54.64) v1(48.56,54.04) v1(48.56,53.44) v1(48.56,48.04) v1(48.56,42.04) v1(48.56,41.44) v1(48.56,40.84) v1(48.56,40.24) v1(48.56,39.64) v1(48.56,39.04) v1(48.56,38.44) v1(48.56,37.84) v1(48.56,37.24) v1(48.56,34.84) v1(48.56,34.24) v1(48.56,33.64) v1(48.56,30.64) v1(48.56,27.04) v1(48.56,26.44) v1(48.56,25.84) v1(48.56,25.24) v1(48.56,15.64) v1(48.56,15.04) v1(48.56,14.44) v1(48.56,13.84) v1(48.56,9.04) v1(48.56,8.44) v1(48.56,7.84) v1(48.56,7.24) v1(48.56,6.64) v1(48.56,6.04) v1(48.56,5.44) v1(48.56,4.84) v1(48.56,4.24) v1(48.56,3.64) v1(48.56,3.04) v1(48.56,2.44) v1(48.56,1.84) v1(48.56,1.24) v1(48.56,0.64) v1(49.16,82.84) v1(49.16,82.24) v1(49.16,81.64) v1(49.16,81.04) v1(49.16,77.44) v1(49.16,76.84) v1(49.16,76.24) v1(49.16,75.64) v1(49.16,75.04) v1(49.16,74.44) v1(49.16,73.84) v1(49.16,73.24) v1(49.16,72.64) v1(49.16,72.04) v1(49.16,71.44) v1(49.16,70.84) v1(49.16,70.24) v1(49.16,67.24) v1(49.16,66.64) v1(49.16,66.04) v1(49.16,65.44) v1(49.16,64.84) v1(49.16,64.24) v1(49.16,63.64) v1(49.16,63.04) v1(49.16,55.24) v1(49.16,54.64) v1(49.16,54.04) v1(49.16,53.44) v1(49.16,48.04) v1(49.16,45.04) v1(49.16,42.04) v1(49.16,41.44) v1(49.16,40.84) v1(49.16,40.24) v1(49.16,39.64) v1(49.16,39.04) v1(49.16,38.44) v1(49.16,37.84) v1(49.16,37.24) v1(49.16,36.64) v1(49.16,15.64) v1(49.16,15.04) v1(49.16,14.44) v1(49.16,13.84) v1(49.16,13.24) v1(49.16,12.64) v1(49.16,12.04) v1(49.16,11.44) v1(49.16,10.84) v1(49.16,10.24) v1(49.16,9.64) v1(49.16,9.04) v1(49.16,8.44) v1(49.16,7.84) v1(49.16,7.24) v1(49.16,6.64) v1(49.16,6.04) v1(49.16,5.44) v1(49.16,4.84) v1(49.16,4.24) v1(49.16,3.64) v1(49.16,3.04) v1(49.16,2.44) v1(49.16,1.84) v1(49.16,1.24) v1(49.16,0.64) v1(49.76,82.84) v1(49.76,82.24) v1(49.76,81.64) v1(49.76,81.04) v1(49.76,80.44) v1(49.76,79.84) v1(49.76,79.24) v1(49.76,78.64) v1(49.76,78.04) v1(49.76,77.44) v1(49.76,76.84) v1(49.76,76.24) v1(49.76,75.64) v1(49.76,75.04) v1(49.76,74.44) v1(49.76,73.84) v1(49.76,73.24) v1(49.76,72.64) v1(49.76,72.04) v1(49.76,71.44) v1(49.76,70.84) v1(49.76,70.24) v1(49.76,67.24) v1(49.76,66.64) v1(49.76,66.04) v1(49.76,65.44) v1(49.76,64.84) v1(49.76,64.24) v1(49.76,63.64) v1(49.76,54.64) v1(49.76,54.04) v1(49.76,53.44) v1(49.76,48.04) v1(49.76,47.44) v1(49.76,46.84) v1(49.76,46.24) v1(49.76,45.64) v1(49.76,45.04) v1(49.76,44.44) v1(49.76,43.84) v1(49.76,43.24) v1(49.76,42.64) v1(49.76,42.04) v1(49.76,41.44) v1(49.76,40.84) v1(49.76,40.24) v1(49.76,39.64) v1(49.76,39.04) v1(49.76,38.44) v1(49.76,37.84) v1(49.76,37.24) v1(49.76,36.64) v1(49.76,36.04) v1(49.76,15.64) v1(49.76,15.04) v1(49.76,14.44) v1(49.76,13.84) v1(49.76,13.24) v1(49.76,12.64) v1(49.76,12.04) v1(49.76,11.44) v1(49.76,10.84) v1(49.76,10.24) v1(49.76,9.64) v1(49.76,9.04) v1(49.76,8.44) v1(49.76,7.84) v1(49.76,7.24) v1(50.36,82.84) v1(50.36,82.24) v1(50.36,81.64) v1(50.36,81.04) v1(50.36,80.44) v1(50.36,79.84) v1(50.36,79.24) v1(50.36,78.64) v1(50.36,78.04) v1(50.36,77.44) v1(50.36,76.84) v1(50.36,76.24) v1(50.36,75.64) v1(50.36,75.04) v1(50.36,74.44) v1(50.36,73.84) v1(50.36,73.24) v1(50.36,72.64) v1(50.36,72.04) v1(50.36,71.44) v1(50.36,70.84) v1(50.36,70.24) v1(50.36,67.24) v1(50.36,66.64) v1(50.36,66.04) v1(50.36,65.44) v1(50.36,64.84) v1(50.36,64.24) v1(50.36,54.04) v1(50.36,53.44) v1(50.36,45.64) v1(50.36,45.04) v1(50.36,44.44) v1(50.36,43.84) v1(50.36,38.44) v1(50.36,37.84) v1(50.36,37.24) v1(50.36,36.64) v1(50.36,36.04) v1(50.36,15.64) v1(50.36,15.04) v1(50.36,13.24) v1(50.36,12.64) v1(50.36,12.04) v1(50.36,11.44) v1(50.36,10.84) v1(50.36,10.24) v1(50.36,9.64) v1(50.36,9.04) v1(50.36,8.44) v1(50.36,7.84) v1(50.36,7.24) v1(50.75,17.59) v1(50.96,82.84) v1(50.96,82.24) v1(50.96,81.64) v1(50.96,81.04) v1(50.96,80.44) v1(50.96,79.84) v1(50.96,79.24) v1(50.96,78.64) v1(50.96,78.04) v1(50.96,77.44) v1(50.96,76.84) v1(50.96,76.24) v1(50.96,75.64) v1(50.96,75.04) v1(50.96,74.44) v1(50.96,73.84) v1(50.96,73.24) v1(50.96,72.64) v1(50.96,72.04) v1(50.96,71.44) v1(50.96,70.84) v1(50.96,67.24) v1(50.96,66.64) v1(50.96,66.04) v1(50.96,65.44) v1(50.96,64.84) v1(50.96,64.24) v1(50.96,53.44) v1(50.96,45.64) v1(50.96,44.44) v1(50.96,43.84) v1(50.96,38.44) v1(50.96,37.84) v1(50.96,37.24) v1(50.96,36.64) v1(50.96,36.04) v1(50.96,25.84) v1(50.96,25.24) v1(50.96,13.24) v1(50.96,12.64) v1(50.96,12.04) v1(50.96,11.44) v1(50.96,10.84) v1(50.96,10.24) v1(50.96,9.64) v1(50.96,9.04) v1(50.96,8.44) v1(50.96,7.84) v1(50.96,7.24) v1(51.41,43.36) v1(51.41,42.58) v1(51.41,41.31) v1(51.56,87.04) v1(51.56,82.24) v1(51.56,81.64) v1(51.56,81.04) v1(51.56,80.44) v1(51.56,79.84) v1(51.56,79.24) v1(51.56,78.64) v1(51.56,78.04) v1(51.56,77.44) v1(51.56,76.84) v1(51.56,76.24) v1(51.56,75.64) v1(51.56,75.04) v1(51.56,74.44) v1(51.56,73.84) v1(51.56,73.24) v1(51.56,72.64) v1(51.56,72.04) v1(51.56,71.44) v1(51.56,67.84) v1(51.56,67.24) v1(51.56,66.64) v1(51.56,66.04) v1(51.56,65.44) v1(51.56,64.84) v1(51.56,64.24) v1(51.56,38.44) v1(51.56,37.84) v1(51.56,37.24) v1(51.56,36.64) v1(51.56,36.04) v1(51.56,14.44) v1(51.56,13.84) v1(51.56,13.24) v1(51.56,12.64) v1(51.56,12.04) v1(51.56,11.44) v1(51.56,10.84) v1(51.56,10.24) v1(51.56,9.64) v1(51.56,9.04) v1(51.56,8.44) v1(51.56,7.84) v1(51.56,7.24) v1(52.16,87.04) v1(52.16,86.44) v1(52.16,81.64) v1(52.16,81.04) v1(52.16,80.44) v1(52.16,79.84) v1(52.16,79.24) v1(52.16,78.64) v1(52.16,78.04) v1(52.16,77.44) v1(52.16,76.84) v1(52.16,76.24) v1(52.16,75.64) v1(52.16,75.04) v1(52.16,74.44) v1(52.16,73.84) v1(52.16,73.24) v1(52.16,72.64) v1(52.16,72.04) v1(52.16,68.44) v1(52.16,67.84) v1(52.16,67.24) v1(52.16,66.64) v1(52.16,66.04) v1(52.16,65.44) v1(52.16,64.84) v1(52.16,64.24) v1(52.16,38.44) v1(52.16,37.84) v1(52.16,37.24) v1(52.16,36.64) v1(52.16,36.04) v1(52.16,14.44) v1(52.16,13.84) v1(52.16,13.24) v1(52.16,12.64) v1(52.16,12.04) v1(52.16,11.44) v1(52.16,10.84) v1(52.16,10.24) v1(52.16,9.64) v1(52.16,9.04) v1(52.16,8.44) v1(52.16,7.84) v1(52.16,7.24) v1(52.76,87.04) v1(52.76,86.44) v1(52.76,85.84) v1(52.76,81.04) v1(52.76,80.44) v1(52.76,79.84) v1(52.76,79.24) v1(52.76,78.64) v1(52.76,78.04) v1(52.76,77.44) v1(52.76,76.84) v1(52.76,76.24) v1(52.76,75.64) v1(52.76,75.04) v1(52.76,74.44) v1(52.76,73.84) v1(52.76,73.24) v1(52.76,72.64) v1(52.76,69.04) v1(52.76,68.44) v1(52.76,67.84) v1(52.76,67.24) v1(52.76,66.64) v1(52.76,66.04) v1(52.76,65.44) v1(52.76,64.84) v1(52.76,64.24) v1(52.76,43.24) v1(52.76,42.64) v1(52.76,42.04) v1(52.76,41.44) v1(52.76,40.84) v1(52.76,40.24) v1(52.76,39.64) v1(52.76,39.04) v1(52.76,38.44) v1(52.76,37.84) v1(52.76,37.24) v1(52.76,36.64) v1(52.76,36.04) v1(52.76,35.44) v1(52.76,30.04) v1(52.76,14.44) v1(52.76,13.84) v1(52.76,9.64) v1(52.76,9.04) v1(52.76,8.44) v1(52.76,7.84) v1(52.76,7.24) v1(53.17,12.62) v1(53.17,10.62) v1(53.36,87.04) v1(53.36,86.44) v1(53.36,85.84) v1(53.36,85.24) v1(53.36,80.44) v1(53.36,79.84) v1(53.36,79.24) v1(53.36,78.64) v1(53.36,78.04) v1(53.36,77.44) v1(53.36,76.84) v1(53.36,76.24) v1(53.36,75.64) v1(53.36,75.04) v1(53.36,74.44) v1(53.36,73.84) v1(53.36,73.24) v1(53.36,69.64) v1(53.36,69.04) v1(53.36,68.44) v1(53.36,67.84) v1(53.36,67.24) v1(53.36,66.64) v1(53.36,66.04) v1(53.36,65.44) v1(53.36,64.84) v1(53.36,64.24) v1(53.36,44.44) v1(53.36,43.84) v1(53.36,43.24) v1(53.36,42.64) v1(53.36,42.04) v1(53.36,41.44) v1(53.36,40.84) v1(53.36,40.24) v1(53.36,39.64) v1(53.36,39.04) v1(53.36,38.44) v1(53.36,37.84) v1(53.36,37.24) v1(53.36,36.64) v1(53.36,36.04) v1(53.36,35.44) v1(53.36,34.84) v1(53.36,34.24) v1(53.36,33.64) v1(53.36,33.04) v1(53.36,32.44) v1(53.36,31.84) v1(53.36,31.24) v1(53.36,30.64) v1(53.36,30.04) v1(53.36,29.44) v1(53.36,14.44) v1(53.36,13.84) v1(53.36,9.64) v1(53.36,9.04) v1(53.36,8.44) v1(53.36,7.84) v1(53.36,7.24) v1(53.52,15.81) v1(53.96,87.04) v1(53.96,86.44) v1(53.96,85.84) v1(53.96,85.24) v1(53.96,84.64) v1(53.96,70.24) v1(53.96,69.64) v1(53.96,69.04) v1(53.96,68.44) v1(53.96,67.84) v1(53.96,67.24) v1(53.96,66.64) v1(53.96,66.04) v1(53.96,65.44) v1(53.96,64.84) v1(53.96,64.24) v1(53.96,46.24) v1(53.96,45.04) v1(53.96,44.44) v1(53.96,43.84) v1(53.96,43.24) v1(53.96,42.64) v1(53.96,42.04) v1(53.96,41.44) v1(53.96,40.84) v1(53.96,40.24) v1(53.96,39.64) v1(53.96,39.04) v1(53.96,38.44) v1(53.96,37.84) v1(53.96,37.24) v1(53.96,36.64) v1(53.96,36.04) v1(53.96,35.44) v1(53.96,34.84) v1(53.96,34.24) v1(53.96,33.64) v1(53.96,33.04) v1(53.96,32.44) v1(53.96,31.84) v1(53.96,31.24) v1(53.96,30.64) v1(53.96,30.04) v1(53.96,29.44) v1(53.96,28.84) v1(53.96,14.44) v1(53.96,13.84) v1(53.96,9.64) v1(53.96,9.04) v1(53.96,8.44) v1(53.96,7.84) v1(53.96,7.24) v1(54.04,12.7) v1(54.04,11.61) v1(54.56,87.04) v1(54.56,86.44) v1(54.56,85.84) v1(54.56,85.24) v1(54.56,84.64) v1(54.56,84.04) v1(54.56,70.84) v1(54.56,70.24) v1(54.56,69.64) v1(54.56,69.04) v1(54.56,68.44) v1(54.56,67.84) v1(54.56,67.24) v1(54.56,66.64) v1(54.56,66.04) v1(54.56,65.44) v1(54.56,64.84) v1(54.56,64.24) v1(54.56,63.64) v1(54.56,51.04) v1(54.56,46.24) v1(54.56,45.64) v1(54.56,45.04) v1(54.56,44.44) v1(54.56,43.84) v1(54.56,43.24) v1(54.56,42.64) v1(54.56,42.04) v1(54.56,41.44) v1(54.56,40.84) v1(54.56,40.24) v1(54.56,39.64) v1(54.56,39.04) v1(54.56,38.44) v1(54.56,37.84) v1(54.56,37.24) v1(54.56,36.64) v1(54.56,36.04) v1(54.56,35.44) v1(54.56,34.84) v1(54.56,34.24) v1(54.56,33.64) v1(54.56,33.04) v1(54.56,32.44) v1(54.56,31.84) v1(54.56,31.24) v1(54.56,30.64) v1(54.56,30.04) v1(54.56,29.44) v1(54.56,28.84) v1(54.56,28.24) v1(54.56,14.44) v1(54.56,13.84) v1(54.56,9.64) v1(54.56,9.04) v1(54.56,8.44) v1(54.56,7.84) v1(54.56,7.24) v1(54.81,12.65) v1(54.81,11.36) v1(55.16,87.04) v1(55.16,86.44) v1(55.16,85.84) v1(55.16,85.24) v1(55.16,84.64) v1(55.16,84.04) v1(55.16,83.44) v1(55.16,71.44) v1(55.16,70.84) v1(55.16,70.24) v1(55.16,69.64) v1(55.16,69.04) v1(55.16,68.44) v1(55.16,67.84) v1(55.16,67.24) v1(55.16,66.64) v1(55.16,66.04) v1(55.16,65.44) v1(55.16,64.84) v1(55.16,64.24) v1(55.16,63.64) v1(55.16,63.04) v1(55.16,51.64) v1(55.16,51.04) v1(55.16,48.64) v1(55.16,48.04) v1(55.16,46.24) v1(55.16,45.64) v1(55.16,45.04) v1(55.16,44.44) v1(55.16,43.84) v1(55.16,43.24) v1(55.16,42.64) v1(55.16,42.04) v1(55.16,41.44) v1(55.16,40.84) v1(55.16,40.24) v1(55.16,39.64) v1(55.16,39.04) v1(55.16,38.44) v1(55.16,37.84) v1(55.16,37.24) v1(55.16,36.64) v1(55.16,36.04) v1(55.16,35.44) v1(55.16,34.84) v1(55.16,34.24) v1(55.16,33.64) v1(55.16,33.04) v1(55.16,32.44) v1(55.16,31.84) v1(55.16,31.24) v1(55.16,30.64) v1(55.16,30.04) v1(55.16,29.44) v1(55.16,28.84) v1(55.16,28.24) v1(55.16,27.64) v1(55.16,16.84) v1(55.16,16.24) v1(55.16,15.64) v1(55.16,15.04) v1(55.16,14.44) v1(55.16,13.84) v1(55.16,9.64) v1(55.16,9.04) v1(55.16,8.44) v1(55.16,7.84) v1(55.16,7.24) v1(55.76,87.04) v1(55.76,86.44) v1(55.76,85.84) v1(55.76,85.24) v1(55.76,84.64) v1(55.76,84.04) v1(55.76,83.44) v1(55.76,82.84) v1(55.76,72.04) v1(55.76,71.44) v1(55.76,70.84) v1(55.76,70.24) v1(55.76,69.64) v1(55.76,69.04) v1(55.76,68.44) v1(55.76,67.84) v1(55.76,67.24) v1(55.76,66.64) v1(55.76,66.04) v1(55.76,65.44) v1(55.76,64.84) v1(55.76,64.24) v1(55.76,63.64) v1(55.76,63.04) v1(55.76,62.44) v1(55.76,61.84) v1(55.76,61.24) v1(55.76,60.64) v1(55.76,60.04) v1(55.76,59.44) v1(55.76,58.84) v1(55.76,58.24) v1(55.76,57.64) v1(55.76,57.04) v1(55.76,56.44) v1(55.76,55.84) v1(55.76,55.24) v1(55.76,54.64) v1(55.76,54.04) v1(55.76,53.44) v1(55.76,52.84) v1(55.76,52.24) v1(55.76,51.64) v1(55.76,51.04) v1(55.76,50.44) v1(55.76,49.84) v1(55.76,49.24) v1(55.76,48.64) v1(55.76,48.04) v1(55.76,47.44) v1(55.76,46.84) v1(55.76,46.24) v1(55.76,45.64) v1(55.76,45.04) v1(55.76,44.44) v1(55.76,43.84) v1(55.76,43.24) v1(55.76,42.64) v1(55.76,42.04) v1(55.76,41.44) v1(55.76,40.84) v1(55.76,40.24) v1(55.76,39.64) v1(55.76,39.04) v1(55.76,38.44) v1(55.76,37.84) v1(55.76,37.24) v1(55.76,36.64) v1(55.76,36.04) v1(55.76,35.44) v1(55.76,34.84) v1(55.76,34.24) v1(55.76,33.64) v1(55.76,33.04) v1(55.76,32.44) v1(55.76,31.84) v1(55.76,31.24) v1(55.76,30.64) v1(55.76,30.04) v1(55.76,29.44) v1(55.76,28.84) v1(55.76,28.24) v1(55.76,27.64) v1(55.76,27.04) v1(55.76,17.44) v1(55.76,16.84) v1(55.76,16.24) v1(55.76,15.64) v1(55.76,15.04) v1(55.76,14.44) v1(55.76,13.84) v1(55.76,9.64) v1(55.76,9.04) v1(55.76,8.44) v1(55.76,7.84) v1(55.76,7.24) v1(56.36,87.04) v1(56.36,86.44) v1(56.36,85.84) v1(56.36,85.24) v1(56.36,84.64) v1(56.36,84.04) v1(56.36,83.44) v1(56.36,82.84) v1(56.36,82.24) v1(56.36,81.64) v1(56.36,81.04) v1(56.36,80.44) v1(56.36,79.84) v1(56.36,79.24) v1(56.36,78.64) v1(56.36,78.04) v1(56.36,77.44) v1(56.36,76.84) v1(56.36,76.24) v1(56.36,75.64) v1(56.36,75.04) v1(56.36,74.44) v1(56.36,73.84) v1(56.36,73.24) v1(56.36,72.64) v1(56.36,72.04) v1(56.36,71.44) v1(56.36,70.84) v1(56.36,70.24) v1(56.36,69.64) v1(56.36,69.04) v1(56.36,68.44) v1(56.36,67.84) v1(56.36,67.24) v1(56.36,66.64) v1(56.36,66.04) v1(56.36,65.44) v1(56.36,64.84) v1(56.36,64.24) v1(56.36,63.64) v1(56.36,63.04) v1(56.36,62.44) v1(56.36,61.84) v1(56.36,61.24) v1(56.36,60.64) v1(56.36,60.04) v1(56.36,59.44) v1(56.36,58.84) v1(56.36,58.24) v1(56.36,57.64) v1(56.36,57.04) v1(56.36,56.44) v1(56.36,55.84) v1(56.36,55.24) v1(56.36,54.64) v1(56.36,54.04) v1(56.36,53.44) v1(56.36,52.84) v1(56.36,52.24) v1(56.36,51.64) v1(56.36,51.04) v1(56.36,50.44) v1(56.36,49.84) v1(56.36,49.24) v1(56.36,48.64) v1(56.36,48.04) v1(56.36,47.44) v1(56.36,46.84) v1(56.36,46.24) v1(56.36,45.64) v1(56.36,45.04) v1(56.36,44.44) v1(56.36,43.84) v1(56.36,43.24) v1(56.36,42.64) v1(56.36,42.04) v1(56.36,41.44) v1(56.36,40.84) v1(56.36,40.24) v1(56.36,39.64) v1(56.36,39.04) v1(56.36,38.44) v1(56.36,37.84) v1(56.36,37.24) v1(56.36,36.64) v1(56.36,36.04) v1(56.36,35.44) v1(56.36,34.84) v1(56.36,34.24) v1(56.36,33.64) v1(56.36,33.04) v1(56.36,32.44) v1(56.36,31.84) v1(56.36,31.24) v1(56.36,30.64) v1(56.36,30.04) v1(56.36,29.44) v1(56.36,28.84) v1(56.36,28.24) v1(56.36,27.64) v1(56.36,27.04) v1(56.36,26.44) v1(56.36,18.04) v1(56.36,17.44) v1(56.36,16.84) v1(56.36,16.24) v1(56.36,15.64) v1(56.36,15.04) v1(56.36,14.44) v1(56.36,13.84) v1(56.36,13.24) v1(56.36,12.64) v1(56.36,12.04) v1(56.36,11.44) v1(56.36,10.84) v1(56.36,10.24) v1(56.36,9.64) v1(56.36,9.04) v1(56.36,8.44) v1(56.36,7.84) v1(56.36,7.24)
